# Altium project VENTUNOQ.PrjPcb (part 6 of 18)

## Sheet USB.SchDoc: USB
size A3; Author: Silvio Navaretti; CompanyName: ARDUINO; DrawnBy: Silvio Navaretti; Engineer: Silvio Navaretti; Organization: ARDUINO; SheetNumber: 30; SheetTotal: 51; RevAuthor: Silvio Navaretti
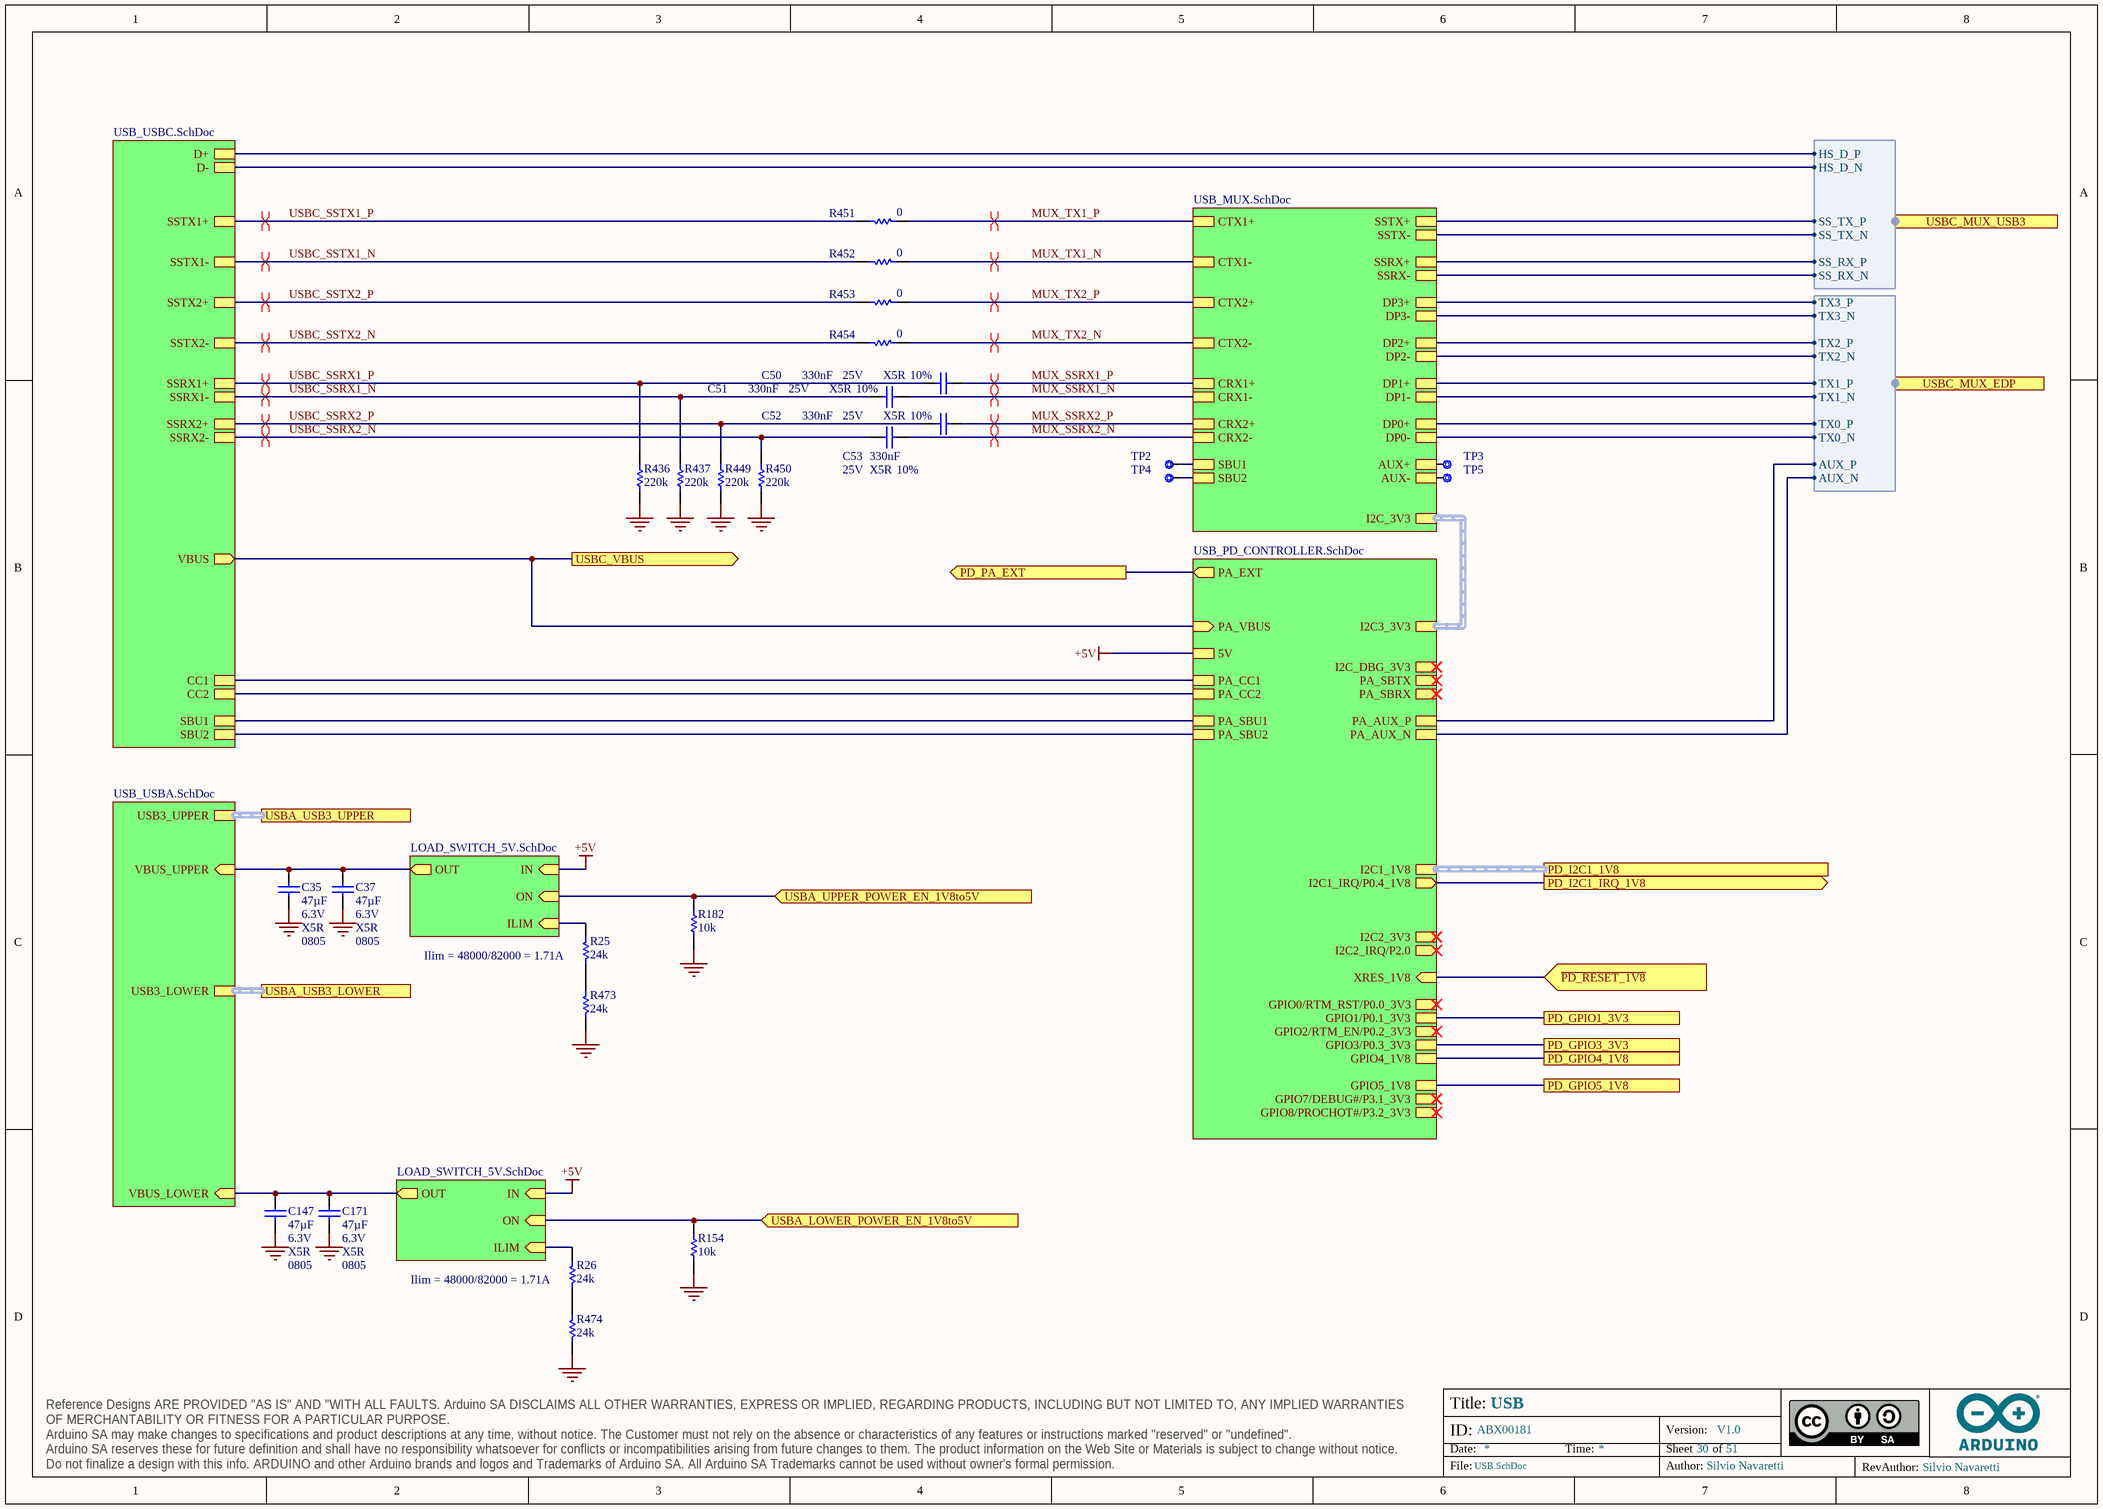
[diagram p11: USB.SchDoc]

### Parts
C35  value 47µF  Voltage: 6.3V  Dielectric: X5R  Case Code (Imperial): 0805  [CAP-0805]  (hidden comment: C0805C476M9PAC7800)
C37  value 47µF  Voltage: 6.3V  Dielectric: X5R  Case Code (Imperial): 0805  [CAP-0805]  (hidden comment: C0805C476M9PAC7800)
C50  value 330nF  Voltage: 25V  Dielectric: X5R  Tolerance: 10%  [CAP-0201]  (hidden comment: CL03A334KA3NRNC)
C51  value 330nF  Voltage: 25V  Dielectric: X5R  Tolerance: 10%  [CAP-0201]  (hidden comment: CL03A334KA3NRNC)
C52  value 330nF  Voltage: 25V  Dielectric: X5R  Tolerance: 10%  [CAP-0201]  (hidden comment: CL03A334KA3NRNC)
C53  value 330nF  Voltage: 25V  Dielectric: X5R  Tolerance: 10%  [CAP-0201]  (hidden comment: CL03A334KA3NRNC)
C147  value 47µF  Voltage: 6.3V  Dielectric: X5R  Case Code (Imperial): 0805  [CAP-0805]  (hidden comment: C0805C476M9PAC7800)
C171  value 47µF  Voltage: 6.3V  Dielectric: X5R  Case Code (Imperial): 0805  [CAP-0805]  (hidden comment: C0805C476M9PAC7800)
R25  value 24k  [RES-0201]  (hidden comment: RC0201FR-0724KL)
R26  value 24k  [RES-0201]  (hidden comment: RC0201FR-0724KL)
R154  value 10k  [RES-0201]  (hidden comment: RC0201FR-0710KL)
R182  value 10k  [RES-0201]  (hidden comment: RC0201FR-0710KL)
R436  value 220k  [RES-0201]  (hidden comment: AC0201FR-07220KL)
R437  value 220k  [RES-0201]  (hidden comment: AC0201FR-07220KL)
R449  value 220k  [RES-0201]  (hidden comment: AC0201FR-07220KL)
R450  value 220k  [RES-0201]  (hidden comment: AC0201FR-07220KL)
R451  value 0  [RES-0201]  (hidden comment: CRCW02010000Z0ED)
R452  value 0  [RES-0201]  (hidden comment: CRCW02010000Z0ED)
R453  value 0  [RES-0201]  (hidden comment: CRCW02010000Z0ED)
R454  value 0  [RES-0201]  (hidden comment: CRCW02010000Z0ED)
R473  value 24k  [RES-0201]  (hidden comment: RC0201FR-0724KL)
R474  value 24k  [RES-0201]  (hidden comment: RC0201FR-0724KL)
TP2  Test point 1.00mm  [TP-1.00MM]  (value not drawn)  (no BOM)
TP3  Test point 1.00mm  [TP-1.00MM]  (value not drawn)  (no BOM)
TP4  Test point 1.00mm  [TP-1.00MM]  (value not drawn)  (no BOM)
TP5  Test point 1.00mm  [TP-1.00MM]  (value not drawn)  (no BOM)

### Sub-sheets
U_LOAD_SWITCH_5V = LOAD_SWITCH_5V.SchDoc: IN (in), OUT (out), ON (in), ILIM (in)
U_LOAD_SWITCH_5V = LOAD_SWITCH_5V.SchDoc: IN (in), OUT (out), ON (in), ILIM (in)
U_USB_MUX = USB_MUX.SchDoc: I2C_3V3 (harness I2C), SSTX-, SSTX+, SBU1, SBU2, SSRX-, SSRX+, DP3+, DP3-, DP2+, DP2-, DP1+, DP1-, DP0+, DP0-, AUX+, AUX-, CTX2+, CTX2-, CRX2+, CRX2-, CRX1+, CRX1-, CTX1+, CTX1-
U_USB_PD_CONTROLLER = USB_PD_CONTROLLER.SchDoc: 5V, PA_VBUS (in), PA_EXT (out), PA_SBU2, PA_SBU1, PA_CC2, PA_CC1, PA_SBTX, PA_SBRX, PA_AUX_P, PA_AUX_N, I2C2_IRQ/P2.0 (out), I2C2_3V3 (harness I2C), I2C3_3V3 (harness I2C), I2C_DBG_3V3 (harness I2C), GPIO0/RTM_RST/P0.0_3V3, GPIO1/P0.1_3V3, GPIO2/RTM_EN/P0.2_3V3, GPIO3/P0.3_3V3, GPIO7/DEBUG#/P3.1_3V3, GPIO8/PROCHOT#/P3.2_3V3, GPIO4_1V8, GPIO5_1V8, I2C1_IRQ/P0.4_1V8 (out), I2C1_1V8 (harness I2C), XRES_1V8 (in)
U_USB_USBA = USB_USBA.SchDoc: VBUS_LOWER (in), USB3_LOWER (harness SOM_MD_USB0), VBUS_UPPER (in), USB3_UPPER (harness SOM_MD_USB0)
U_USB_USBC = USB_USBC.SchDoc: D-, D+, CC1, CC2, SSTX2-, SSTX2+, SSTX1-, SSTX1+, VBUS (out), SBU1, SBU2, SSRX2-, SSRX2+, SSRX1-, SSRX1+

### Ports
PD_GPIO1_3V3, PD_GPIO3_3V3, PD_GPIO4_1V8, PD_GPIO5_1V8, PD_I2C1_1V8 (harness I2C), PD_I2C1_IRQ_1V8 (out), PD_PA_EXT (out), USBA_LOWER_POWER_EN_1V8to5V (in), USBA_UPPER_POWER_EN_1V8to5V (in), USBA_USB3_LOWER (harness SOM_MD_EDP0), USBA_USB3_UPPER (harness SOM_MD_EDP0), USBC_MUX_EDP (harness SOM_MD_EDP0), USBC_MUX_USB3 (harness SOM_MD_USB0), USBC_VBUS (out), ~{PD_RESET_1V8} (in)

### Harnesses
SOM_MD_USB0: SS_TX_N, SS_TX_P, HS_D_P, HS_D_N, SS_RX_P, SS_RX_N
SOM_MD_EDP0: TX0_P, TX1_P, TX2_P, TX3_P, AUX_P, TX0_N, TX1_N, TX2_N, TX3_N, AUX_N

### Nets
+5V: sheet U_USB_PD_CONTROLLER/5V, sheet U_LOAD_SWITCH_5V/IN, sheet U_LOAD_SWITCH_5V/IN
GND: C35.1 C37.1 C147.1 C171.1 R154.1 R182.1 R436.2 R437.2 R449.2 R450.2 R473.1 R474.1
EDP0_AUX_N: sheet U_USB_PD_CONTROLLER/PA_AUX_N, port USBC_MUX_EDP.AUX_N
EDP0_AUX_P: sheet U_USB_PD_CONTROLLER/PA_AUX_P, port USBC_MUX_EDP.AUX_P
EDP0_TX0_N: sheet U_USB_MUX/DP0-, port USBC_MUX_EDP.TX0_N
EDP0_TX0_P: sheet U_USB_MUX/DP0+, port USBC_MUX_EDP.TX0_P
EDP0_TX1_N: sheet U_USB_MUX/DP1-, port USBC_MUX_EDP.TX1_N
EDP0_TX1_P: sheet U_USB_MUX/DP1+, port USBC_MUX_EDP.TX1_P
EDP0_TX2_N: sheet U_USB_MUX/DP2-, port USBC_MUX_EDP.TX2_N
EDP0_TX2_P: sheet U_USB_MUX/DP2+, port USBC_MUX_EDP.TX2_P
EDP0_TX3_N: sheet U_USB_MUX/DP3-, port USBC_MUX_EDP.TX3_N
EDP0_TX3_P: sheet U_USB_MUX/DP3+, port USBC_MUX_EDP.TX3_P
MD_GPIO_3: port PD_I2C1_IRQ_1V8, sheet U_USB_PD_CONTROLLER/I2C1_IRQ/P0.4_1V8
MD_GPIO_48: port PD_GPIO5_1V8, sheet U_USB_PD_CONTROLLER/GPIO5_1V8
MD_GPIO_94: port PD_GPIO4_1V8, sheet U_USB_PD_CONTROLLER/GPIO4_1V8
MD_GPIO_104: port ~{PD_RESET_1V8}, sheet U_USB_PD_CONTROLLER/XRES_1V8
MD_USB0_3.1.HS_D_N: sheet U_USB_USBC/D-, port USBC_MUX_USB3.HS_D_N
MD_USB0_3.1.HS_D_P: sheet U_USB_USBC/D+, port USBC_MUX_USB3.HS_D_P
MD_USB0_3.1.SS_RX_N: sheet U_USB_MUX/SSRX-, port USBC_MUX_USB3.SS_RX_N
MD_USB0_3.1.SS_RX_P: sheet U_USB_MUX/SSRX+, port USBC_MUX_USB3.SS_RX_P
MD_USB0_3.1.SS_TX_N: sheet U_USB_MUX/SSTX-, port USBC_MUX_USB3.SS_TX_N
MD_USB0_3.1.SS_TX_P: sheet U_USB_MUX/SSTX+, port USBC_MUX_USB3.SS_TX_P
MUX_SSRX1_N: C51.1 ; sheet U_USB_MUX/CRX1-
MUX_SSRX1_P: C50.1 ; sheet U_USB_MUX/CRX1+
MUX_SSRX2_N: C53.1 ; sheet U_USB_MUX/CRX2-
MUX_SSRX2_P: C52.1 ; sheet U_USB_MUX/CRX2+
MUX_TX1_N: R452.2 ; sheet U_USB_MUX/CTX1-
MUX_TX1_P: R451.2 ; sheet U_USB_MUX/CTX1+
MUX_TX2_N: R454.2 ; sheet U_USB_MUX/CTX2-
MUX_TX2_P: R453.2 ; sheet U_USB_MUX/CTX2+
PA_VBUS: port USBC_VBUS, sheet U_USB_USBC/VBUS, sheet U_USB_PD_CONTROLLER/PA_VBUS
USBC_CC1: sheet U_USB_USBC/CC1, sheet U_USB_PD_CONTROLLER/PA_CC1
USBC_CC2: sheet U_USB_USBC/CC2, sheet U_USB_PD_CONTROLLER/PA_CC2
USBC_SBU1: sheet U_USB_USBC/SBU1, sheet U_USB_PD_CONTROLLER/PA_SBU1
USBC_SBU2: sheet U_USB_USBC/SBU2, sheet U_USB_PD_CONTROLLER/PA_SBU2
USBC_SSRX1_N: C51.2 R437.1 ; sheet U_USB_USBC/SSRX1-
USBC_SSRX1_P: C50.2 R436.1 ; sheet U_USB_USBC/SSRX1+
USBC_SSRX2_N: C53.2 R450.1 ; sheet U_USB_USBC/SSRX2-
USBC_SSRX2_P: C52.2 R449.1 ; sheet U_USB_USBC/SSRX2+
USBC_SSTX1_N: R452.1 ; sheet U_USB_USBC/SSTX1-
USBC_SSTX1_P: R451.1 ; sheet U_USB_USBC/SSTX1+
USBC_SSTX2_N: R454.1 ; sheet U_USB_USBC/SSTX2-
USBC_SSTX2_P: R453.1 ; sheet U_USB_USBC/SSTX2+
NetC35_2: C35.2 C37.2 ; sheet U_USB_USBA/VBUS_UPPER, sheet U_LOAD_SWITCH_5V/OUT
NetC147_2: C147.2 C171.2 ; sheet U_USB_USBA/VBUS_LOWER, sheet U_LOAD_SWITCH_5V/OUT
NetQ3_2: port PD_GPIO3_3V3, sheet U_USB_PD_CONTROLLER/GPIO3/P0.3_3V3
NetQ3_3: port PD_GPIO1_3V3, sheet U_USB_PD_CONTROLLER/GPIO1/P0.1_3V3
NetR25_1: R25.1 R473.2
NetR25_2: R25.2 ; sheet U_LOAD_SWITCH_5V/ILIM
NetR26_1: R26.1 R474.2
NetR26_2: R26.2 ; sheet U_LOAD_SWITCH_5V/ILIM
NetR154_2: R154.2 ; port USBA_LOWER_POWER_EN_1V8to5V, sheet U_LOAD_SWITCH_5V/ON
NetR182_2: R182.2 ; port USBA_UPPER_POWER_EN_1V8to5V, sheet U_LOAD_SWITCH_5V/ON
NetR215_1: port PD_PA_EXT, sheet U_USB_PD_CONTROLLER/PA_EXT
NetTP2_X: TP2.X ; sheet U_USB_MUX/SBU1
NetTP3_X: TP3.X ; sheet U_USB_MUX/AUX+
NetTP4_X: TP4.X ; sheet U_USB_MUX/SBU2
NetTP5_X: TP5.X ; sheet U_USB_MUX/AUX-

### Buses and harness runs
harness port PD_I2C1_1V8 = sheet U_USB_PD_CONTROLLER/I2C1_1V8
harness port USBA_USB3_LOWER = sheet U_USB_USBA/USB3_LOWER
harness port USBA_USB3_UPPER = sheet U_USB_USBA/USB3_UPPER
harness sheet U_USB_MUX/I2C_3V3 = sheet U_USB_PD_CONTROLLER/I2C3_3V3

### Layout directives
differential pair; differential pair class DIFF_MUX_USBC; net class NET_DIFF_USBC: MUX_SSRX1_N, MUX_SSRX1_P, MUX_SSRX2_N, MUX_SSRX2_P, MUX_TX1_N, MUX_TX1_P, MUX_TX2_N, MUX_TX2_P
differential pair; differential pair class DIFF_MUXCAPS_USBC; net class NET_DIFF_USB: USBC_SSRX1_N, USBC_SSRX1_P, USBC_SSRX2_N, USBC_SSRX2_P, USBC_SSTX1_N, USBC_SSTX1_P, USBC_SSTX2_N, USBC_SSTX2_P

### Notes on the sheet
- (near R25) Ilim = 48000/82000 = 1.71A
- (near R26) Ilim = 48000/82000 = 1.71A
- Title:
- ID:
- Date:
- Time:
- Version:
- Sheet
- of
- RevAuthor:
- Reference Designs ARE PROVIDED "AS IS" AND "WITH ALL FAULTS. Arduino SA DISCLAIMS ALL OTHER WARRANTIES, EXPRESS OR IMPLIED, REGARDING PRODUCTS, INCLUDING BUT NOT LIMITED TO, ANY IMPLIED WARRANTIES OF MERCHANTABILITY OR FITNESS FOR A PARTICULAR PURPOSE.
  Arduino SA may make changes to specifications and product descriptions at any time, without notice. The Customer must not rely on the absence or characteristics of any features or instructions marked "reserved" or "undefined".
  Arduino SA reserves these for future definition and shall have no responsibility whatsoever for conflicts or incompatibilities arising from future changes to them. The product information on the Web Site or Materials is subject to change without notice.
  Do not finalize a design with this info. ARDUINO and other Arduino brands and logos and Trademarks of Arduino SA. All Arduino SA Trademarks cannot be used without owner's formal permission.
- File:
- Author:

### Library data of the parts
C35 C37 C147 C171 = C0199-A.1: CAP CHIP 0805 47uF 20% 6.3V X5R; Manufacturer: KEMET; Code Arduino: C0199; Technology: Ceramic; Tolerance: 20%; Part Number: C0805C476M9PAC7800
C50-C53 = C0201-A.1: CAP CHIP 0201 330nF 10% 25V X5R; Manufacturer: Samsung Electro-Mechanics; Code Arduino: C0201; Part Number: CL03A334KA3NRNC; Case Code (Imperial): 0201; Technology: Ceramic
R25 R26 R473 R474 = R0398-A.1: RES CHIP 0201 24k 1% 1/20W; Manufacturer: YAGEO; Power: 50mW; Code Arduino: R0398; Temperature Coefficient: 200ppm; Technology: Thick film; Tolerance: 1%; Case Code (Imperial): 0201; Part Number: RC0201FR-0724KL
R154 R182 = R0145-A.21: RES CHIP 0201 10k 1% 1/20W; Manufacturer: Yageo; Power: 50mW; Temperature coefficient: 200ppm; Code Arduino: R0145; Manufacturer 2: Samsung Electro-Mechanics; Tolerance: 1%; Case Code (Imperial): 0201; Part Number: RC0201FR-0710KL; Technology: Thick film
R436 R437 R449 R450 = R0199-A.20: RES CHIP 0201 220k 1% 1/20W; Manufacturer: Yageo; Temperature coefficient: 200ppm; Power: 50mW; Code Arduino: R0199; Part Number: AC0201FR-07220KL; Tolerance: 1%; Case Code (Imperial): 0201; Technology: Thick film
R451-R454 = R0140-A.21: RES CHIP 0201 0R; Manufacturer: Vishay; Tolerance: 0%; Code Arduino: R0140; Temperature coefficient: 0ppm; Power: 50mW; Technology: Thick film; Case Code (Imperial): 0201; Part Number: CRCW02010000Z0ED
TP2-TP5 = UT0013-A.6: Part Number: This is not a component; Design Item ID: CMP-018-0005-A.3; Source: ut.SchLib; Manufacturer: This is not a component; Code Arduino: This is not a component; Pin Count: 1

## Sheet USB_USBC.SchDoc: USBC
size A3; Author: Silvio Navaretti; CompanyName: ARDUINO; DrawnBy: Silvio Navaretti; Engineer: Silvio Navaretti; Organization: ARDUINO; SheetNumber: 31; SheetTotal: 51; RevAuthor: Silvio Navaretti
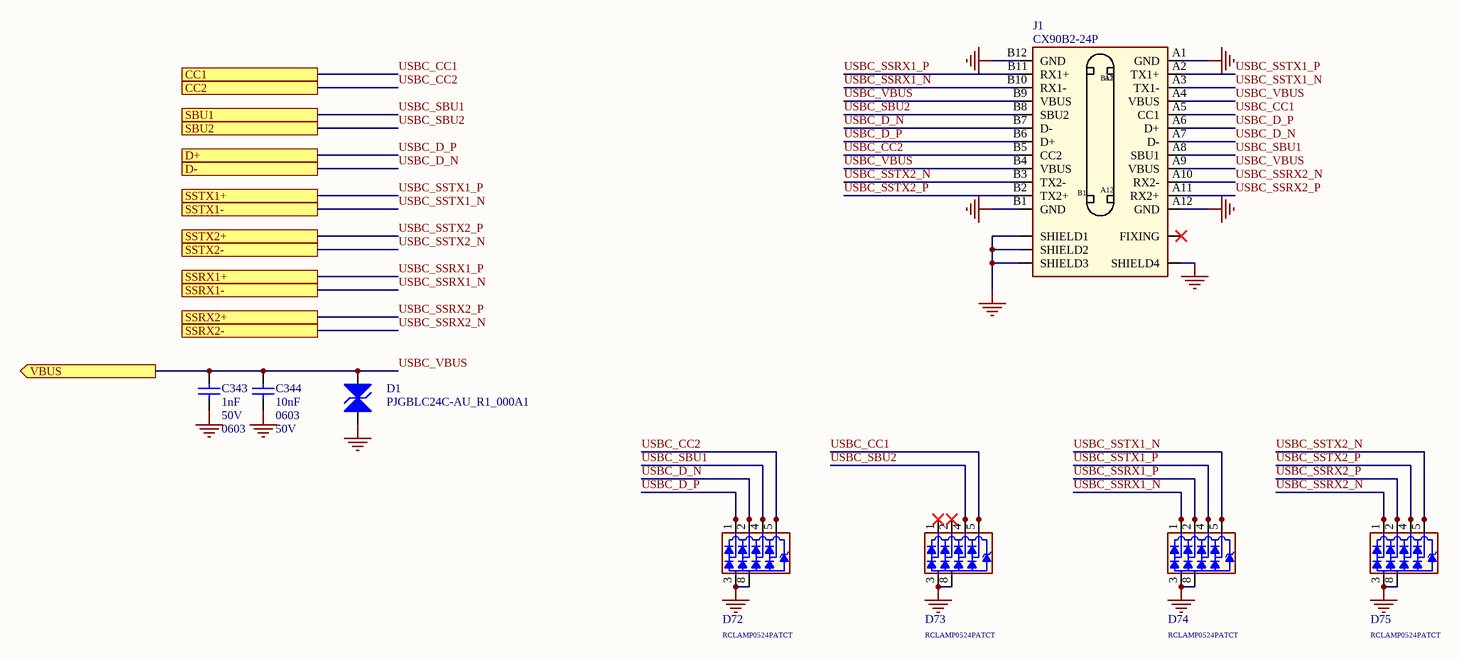
[diagram p12: USB_USBC.SchDoc]

### Parts
C343  value 1nF  Voltage: 50V  Case Code (Imperial): 0603  [CAP-0603]  (hidden comment: CL10B102KB8WPNC)
C344  value 10nF  Case Code (Imperial): 0603  Voltage: 50V  [CAP-0603]  (hidden comment: 0603B103K500CT)
D1  PJGBLC24C-AU_R1_000A1  [SOD323 NO POLARITY]
D72  RCLAMP0524PATCT  [SLP2510P8]
D73  RCLAMP0524PATCT  [SLP2510P8]
D74  RCLAMP0524PATCT  [SLP2510P8]
D75  RCLAMP0524PATCT  [SLP2510P8]
J1  CX90B2-24P  [CX90B2-24P]

### Ports
CC1, CC2, D+, D-, SBU1, SBU2, SSRX1+, SSRX1-, SSRX2+, SSRX2-, SSTX1+, SSTX1-, SSTX2+, SSTX2-, VBUS (out)

### Nets
GND: C343.2 C344.2 D1.1(A1) D72.3 D72.8 D73.3 D73.8 D74.3 D74.8 D75.3 D75.8 J1.A1(GND) J1.A12(GND) J1.B1(GND) J1.B12(GND) J1.SHIELD1 J1.SHIELD2 J1.SHIELD3 J1.SHIELD4
USBC_CC1: D73.5 D73.6 J1.A5(CC1) ; port CC1
USBC_CC2: D72.5 D72.6 J1.B5(CC2) ; port CC2
USBC_D_N: D72.2 D72.9 J1.A7(D-) J1.B7(D-) ; port D-  [project net MD_USB0_3.1.HS_D_N]
USBC_D_P: D72.1 D72.10 J1.A6(D+) J1.B6(D+) ; port D+  [project net MD_USB0_3.1.HS_D_P]
USBC_SBU1: D72.4 D72.7 J1.A8(SBU1) ; port SBU1
USBC_SBU2: D73.4 D73.7 J1.B8(SBU2) ; port SBU2
USBC_SSRX1_N: D74.1 D74.10 J1.B10(RX1-) ; port SSRX1-
USBC_SSRX1_P: D74.2 D74.9 J1.B11(RX1+) ; port SSRX1+
USBC_SSRX2_N: D75.1 D75.10 J1.A10(RX2-) ; port SSRX2-
USBC_SSRX2_P: D75.2 D75.9 J1.A11(RX2+) ; port SSRX2+
USBC_SSTX1_N: D74.5 D74.6 J1.A3(TX1-) ; port SSTX1-
USBC_SSTX1_P: D74.4 D74.7 J1.A2(TX1+) ; port SSTX1+
USBC_SSTX2_N: D75.5 D75.6 J1.B3(TX2-) ; port SSTX2-
USBC_SSTX2_P: D75.4 D75.7 J1.B2(TX2+) ; port SSTX2+
USBC_VBUS: C343.1 C344.1 D1.2(A2) J1.A4(VBUS) J1.A9(VBUS) J1.B4(VBUS) J1.B9(VBUS) ; port VBUS  [project net PA_VBUS]
NetD73_1: D73.1 D73.10
NetD73_2: D73.2 D73.9

Not connected (* = marked no-connect by the designer): J1 FIXING*

### Notes on the sheet
- Title:
- ID:
- Date:
- Time:
- Version:
- Sheet
- of
- RevAuthor:
- Reference Designs ARE PROVIDED "AS IS" AND "WITH ALL FAULTS. Arduino SA DISCLAIMS ALL OTHER WARRANTIES, EXPRESS OR IMPLIED, REGARDING PRODUCTS, INCLUDING BUT NOT LIMITED TO, ANY IMPLIED WARRANTIES OF MERCHANTABILITY OR FITNESS FOR A PARTICULAR PURPOSE.
  Arduino SA may make changes to specifications and product descriptions at any time, without notice. The Customer must not rely on the absence or characteristics of any features or instructions marked "reserved" or "undefined".
  Arduino SA reserves these for future definition and shall have no responsibility whatsoever for conflicts or incompatibilities arising from future changes to them. The product information on the Web Site or Materials is subject to change without notice.
  Do not finalize a design with this info. ARDUINO and other Arduino brands and logos and Trademarks of Arduino SA. All Arduino SA Trademarks cannot be used without owner's formal permission.
- File:
- Author:

### Library data of the parts
C343 = C0063-A.3: CAP CHIP 0603 1nF 10% 50V X7R; Manufacturer: Samsung Electro-Mechanics; Code Arduino: C0063; Tolerance: 10%; Part Number: CL10B102KB8WPNC; Dielectric: X7R
C344 = C0040-A.14: CAP CHIP 0603 10nF 10% 50V X7R; Manufacturer: Walsin; Code Arduino: 0142; Technology: Ceramic; Part number 3: CL10B103KC8NNNC; Part Number: 0603B103K500CT; Dielectric: X7R; Manufacturer 2: Hottech; Part number 2: C1608B103K500NT; Tolerance: 10%
D1 = D0098-A.2: TVS BIDIRECTIONAL SMD Vr 24V, Vbr min 27.27V, 350W, SOD-323; V(BR) Typ (V): 26.7; Code Arduino: D0098; Part Number: PJGBLC24C-AU_R1_000A1
D72-D75 = D0097-A.6: TVS UNIDIRECTIONAL 4CH 0.8pF 5V SLP2510P8 10-pin 2.5x1.0x0.58mm; Manufacturer: SEMTECH; Code Arduino: D0097; Device Type: ESD protection; Part Number: RCLAMP0524PATCT
J1 = J0010-A.12: CONN RCPT USB3.1 TYPEC 24POS SMD; Manufacturer: Hirose; Code Arduino: A5518; Gender: Receptacle; Connector Type: USB; Part Number: CX90B2-24P

## Sheet USB_MUX.SchDoc: USB MUX
size A3; Author: Silvio Navaretti; CompanyName: ARDUINO; DrawnBy: Silvio Navaretti; Engineer: Silvio Navaretti; Organization: ARDUINO; SheetNumber: 32; SheetTotal: 51; RevAuthor: Silvio Navaretti
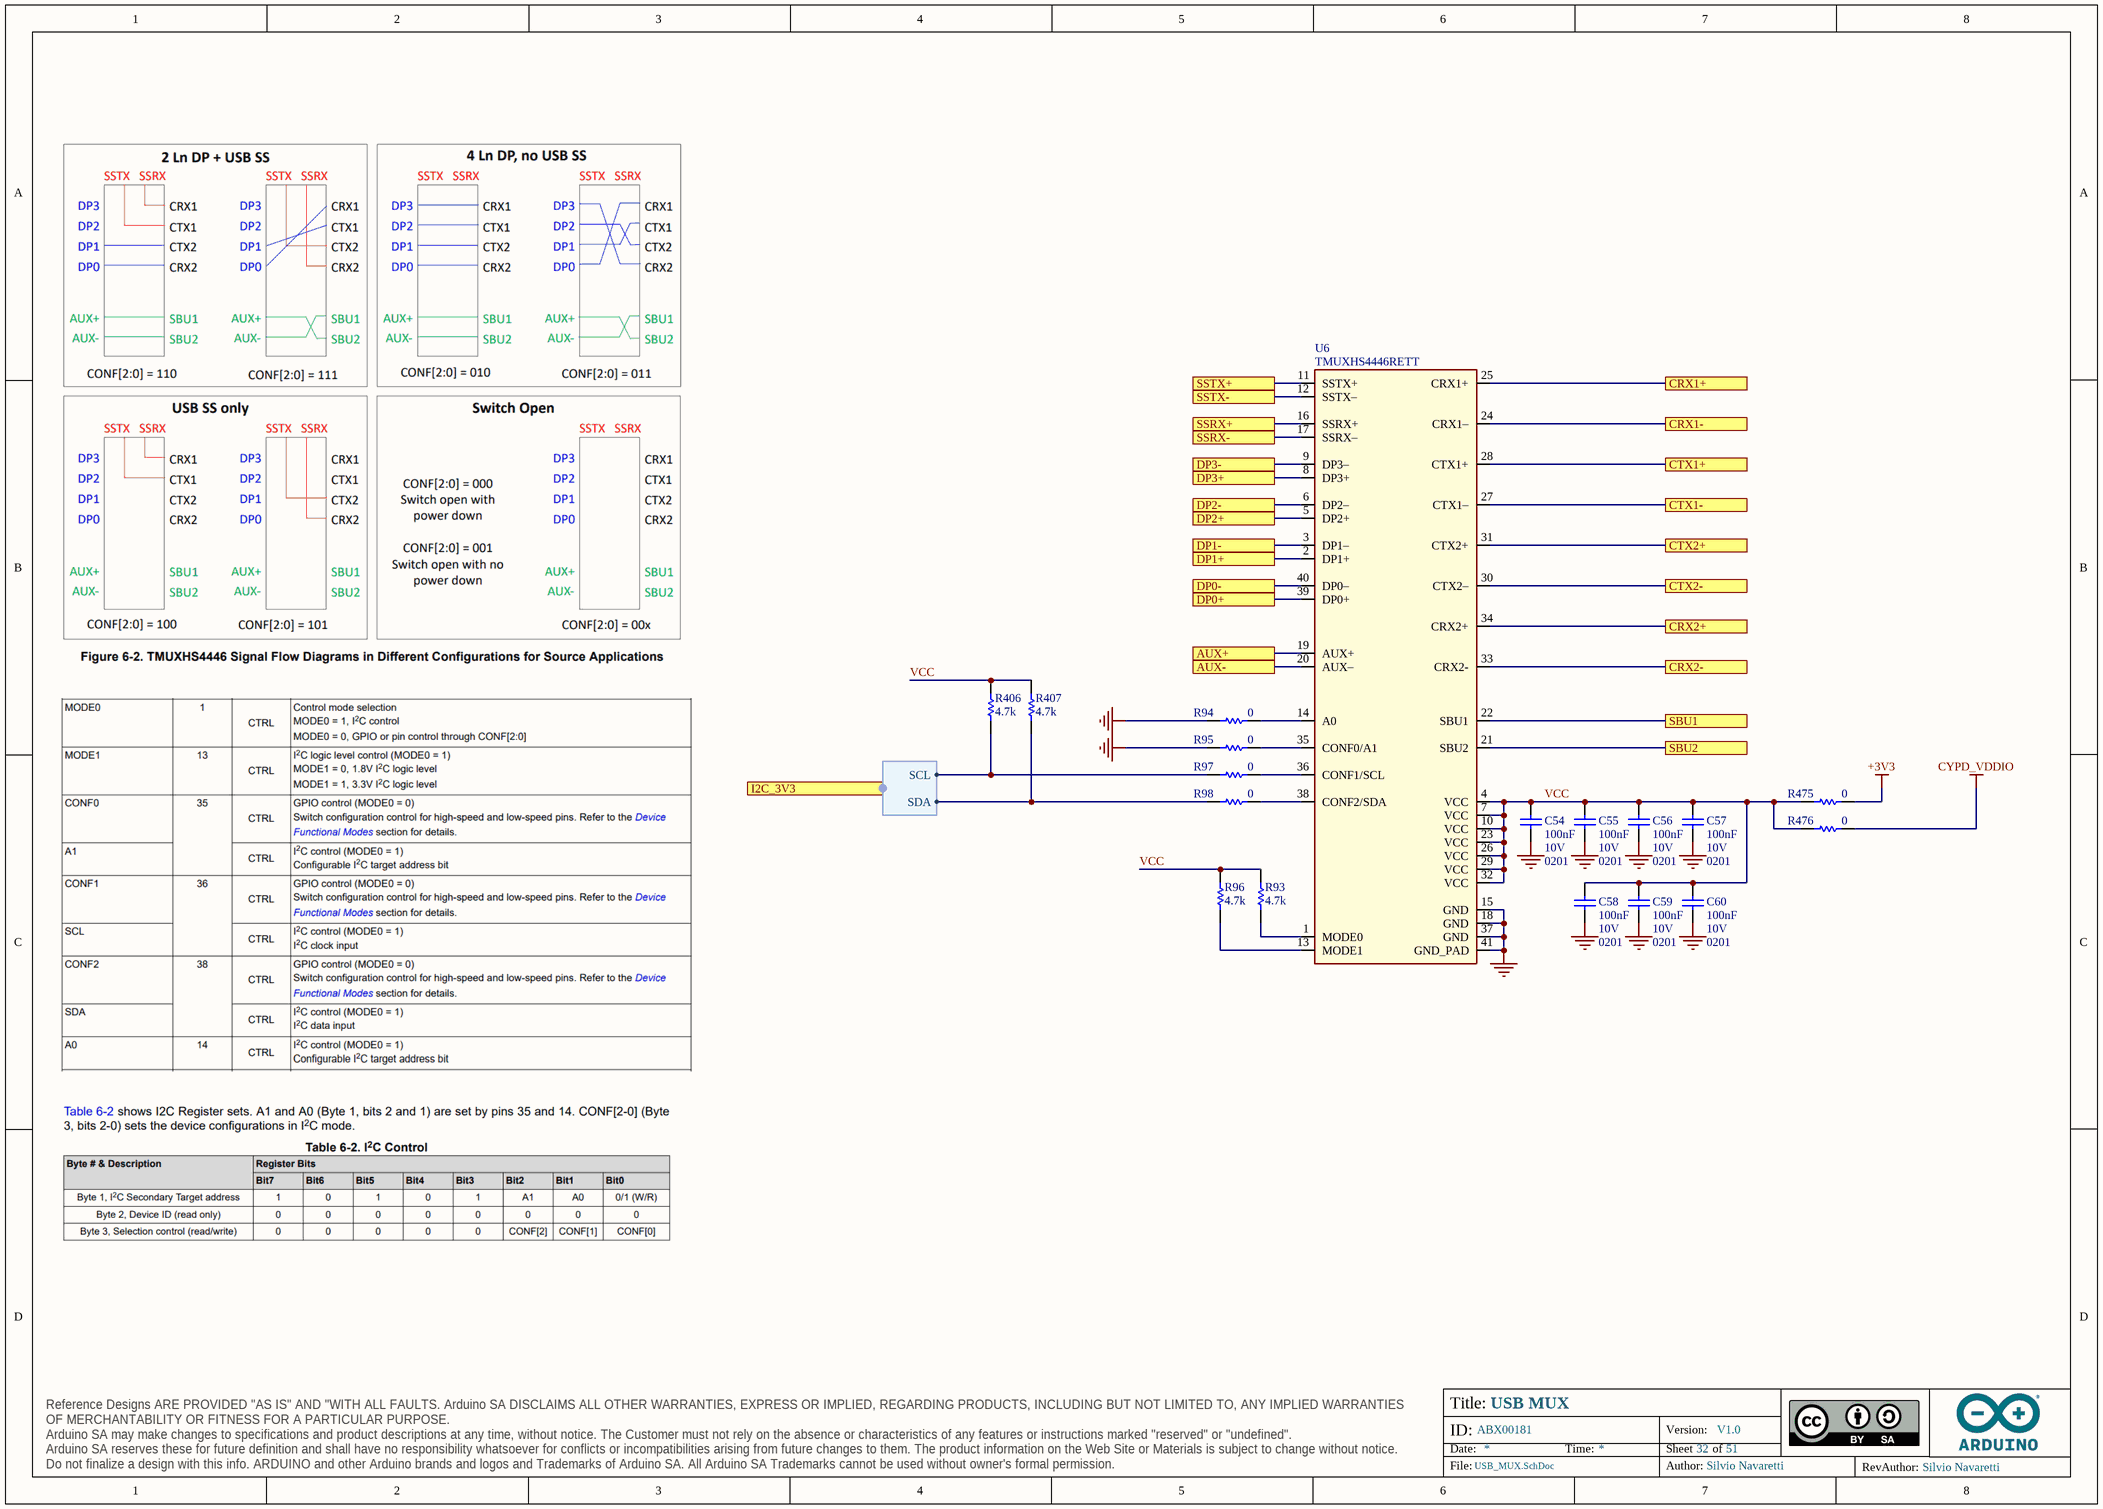
[diagram p13: USB_MUX.SchDoc]

### Parts
C54  value 100nF  Voltage: 10V  Case Code (Imperial): 0201  [CAP-0201]  (hidden comment: CL03A104KP3NNNC)
C55  value 100nF  Voltage: 10V  Case Code (Imperial): 0201  [CAP-0201]  (hidden comment: CL03A104KP3NNNC)
C56  value 100nF  Voltage: 10V  Case Code (Imperial): 0201  [CAP-0201]  (hidden comment: CL03A104KP3NNNC)
C57  value 100nF  Voltage: 10V  Case Code (Imperial): 0201  [CAP-0201]  (hidden comment: CL03A104KP3NNNC)
C58  value 100nF  Voltage: 10V  Case Code (Imperial): 0201  [CAP-0201]  (hidden comment: CL03A104KP3NNNC)
C59  value 100nF  Voltage: 10V  Case Code (Imperial): 0201  [CAP-0201]  (hidden comment: CL03A104KP3NNNC)
C60  value 100nF  Voltage: 10V  Case Code (Imperial): 0201  [CAP-0201]  (hidden comment: CL03A104KP3NNNC)
R93  value 4.7k  [RES-0201]  (hidden comment: RC0201FR-074K7L)
R94  value 0  [RES-0201]  (hidden comment: CRCW02010000Z0ED)
R95  value 0  [RES-0201]  (hidden comment: CRCW02010000Z0ED)
R96  value 4.7k  [RES-0201]  (hidden comment: RC0201FR-074K7L)
R97  value 0  [RES-0201]  (hidden comment: CRCW02010000Z0ED)
R98  value 0  [RES-0201]  (hidden comment: CRCW02010000Z0ED)
R406  value 4.7k  [RES-0201]  (hidden comment: RC0201FR-074K7L)
R407  value 4.7k  [RES-0201]  (hidden comment: RC0201FR-074K7L)
R475  value 0  [RES-0201]  (hidden comment: CRCW02010000Z0ED)
R476  value 0  [RES-0201]  (hidden comment: CRCW02010000Z0ED)
U6  TMUXHS4446RETT  [TI QWFN40 RET0040A Pitch 0.4mm 3x6mm]

### Ports
AUX+, AUX-, CRX1+, CRX1-, CRX2+, CRX2-, CTX1+, CTX1-, CTX2+, CTX2-, DP0+, DP0-, DP1+, DP1-, DP2+, DP2-, DP3+, DP3-, I2C_3V3 (harness I2C), SBU1, SBU2, SSRX+, SSRX-, SSTX+, SSTX-

### Harnesses
I2C: SDA, SCL

### Nets
+3V3: R475.2
CYPD_VDDIO: R476.2
GND: C54.1 C55.1 C56.1 C57.1 C58.1 C59.1 C60.1 R94.1 R95.1 U6.15(GND) U6.18(GND) U6.37(GND) U6.41(GND_PAD)
EDP0_TX0_N: U6.40(DP0–) ; port DP0-
EDP0_TX0_P: U6.39(DP0+) ; port DP0+
EDP0_TX1_N: U6.3(DP1–) ; port DP1-
EDP0_TX1_P: U6.2(DP1+) ; port DP1+
EDP0_TX2_N: U6.6(DP2–) ; port DP2-
EDP0_TX2_P: U6.5(DP2+) ; port DP2+
EDP0_TX3_N: U6.9(DP3–) ; port DP3-
EDP0_TX3_P: U6.8(DP3+) ; port DP3+
MD_USB0_3.1.SS_RX_N: U6.17(SSRX–) ; port SSRX-
MD_USB0_3.1.SS_RX_P: U6.16(SSRX+) ; port SSRX+
MD_USB0_3.1.SS_TX_N: U6.12(SSTX–) ; port SSTX-
MD_USB0_3.1.SS_TX_P: U6.11(SSTX+) ; port SSTX+
MUX_SSRX1_N: U6.24(CRX1–) ; port CRX1-
MUX_SSRX1_P: U6.25(CRX1+) ; port CRX1+
MUX_SSRX2_N: U6.33(CRX2-) ; port CRX2-
MUX_SSRX2_P: U6.34(CRX2+) ; port CRX2+
MUX_TX1_N: U6.27(CTX1–) ; port CTX1-
MUX_TX1_P: U6.28(CTX1+) ; port CTX1+
MUX_TX2_N: U6.30(CTX2–) ; port CTX2-
MUX_TX2_P: U6.31(CTX2+) ; port CTX2+
VCC: C54.2 C55.2 C56.2 C57.2 C58.2 C59.2 C60.2 R93.1 R96.1 R406.1 R407.1 R475.1 R476.1 U6.4(VCC) U6.7(VCC) U6.10(VCC) U6.23(VCC) U6.26(VCC) U6.29(VCC) U6.32(VCC)  [project net VCC_32]
NetR93_2: R93.2 U6.1(MODE0)
NetR94_2: R94.2 U6.14(A0)
NetR95_2: R95.2 U6.35(CONF0/A1)
NetR96_2: R96.2 U6.13(MODE1)
NetR97_1: R97.1 R406.2 ; port I2C_3V3.SCL
NetR97_2: R97.2 U6.36(CONF1/SCL)
NetR98_1: R98.1 R407.2 ; port I2C_3V3.SDA
NetR98_2: R98.2 U6.38(CONF2/SDA)
NetTP2_X: U6.22(SBU1) ; port SBU1
NetTP3_X: U6.19(AUX+) ; port AUX+
NetTP4_X: U6.21(SBU2) ; port SBU2
NetTP5_X: U6.20(AUX–) ; port AUX-

### Notes on the sheet
- Title:
- ID:
- Date:
- Time:
- Version:
- Sheet
- of
- RevAuthor:
- Reference Designs ARE PROVIDED "AS IS" AND "WITH ALL FAULTS. Arduino SA DISCLAIMS ALL OTHER WARRANTIES, EXPRESS OR IMPLIED, REGARDING PRODUCTS, INCLUDING BUT NOT LIMITED TO, ANY IMPLIED WARRANTIES OF MERCHANTABILITY OR FITNESS FOR A PARTICULAR PURPOSE.
  Arduino SA may make changes to specifications and product descriptions at any time, without notice. The Customer must not rely on the absence or characteristics of any features or instructions marked "reserved" or "undefined".
  Arduino SA reserves these for future definition and shall have no responsibility whatsoever for conflicts or incompatibilities arising from future changes to them. The product information on the Web Site or Materials is subject to change without notice.
  Do not finalize a design with this info. ARDUINO and other Arduino brands and logos and Trademarks of Arduino SA. All Arduino SA Trademarks cannot be used without owner's formal permission.
- File:
- Author:

### Library data of the parts
C54-C60 = C0113-A.6: CAP CHIP 0201 100nF 10% 10V X5R; Manufacturer: Samsung Electro-Mechanics; Code Arduino: C0113; Technology: Ceramic; Part Number: CL03A104KP3NNNC; Dielectric: X5R; Tolerance: 10%
R93 R96 R406 R407 = R0151-A.21: RES CHIP 0201 4k7 1% 1/20W; Manufacturer: Yageo; Temperature coefficient: 200ppm; Power: 50mW; Code Arduino: A5521; Technology: Thick film; Case Code (Imperial): 0201; Part Number: RC0201FR-074K7L; Tolerance: 1%
R94 R95 R97 R98 R475 R476 = R0140-A.21: RES CHIP 0201 0R; Manufacturer: Vishay; Temperature coefficient: 0ppm; Code Arduino: R0140; Power: 50mW; Tolerance: 0%; Technology: Thick film; Case Code (Imperial): 0201; Part Number: CRCW02010000Z0ED
U6 = U0499-A.3: IC MUX Alt Mode Crossbar USB-C 10Gbps, QFN40 3x6mm; Manufacturer: Texas Instruments; Code Arduino: U0499; Part Number: TMUXHS4446RETT

## Sheet USB_PD_CONTROLLER.SchDoc: USB PD CONTROLLER
size A3; Author: Silvio Navaretti; CompanyName: ARDUINO; DrawnBy: Silvio Navaretti; Engineer: Silvio Navaretti; Organization: ARDUINO; SheetNumber: 33; SheetTotal: 51; RevAuthor: Silvio Navaretti
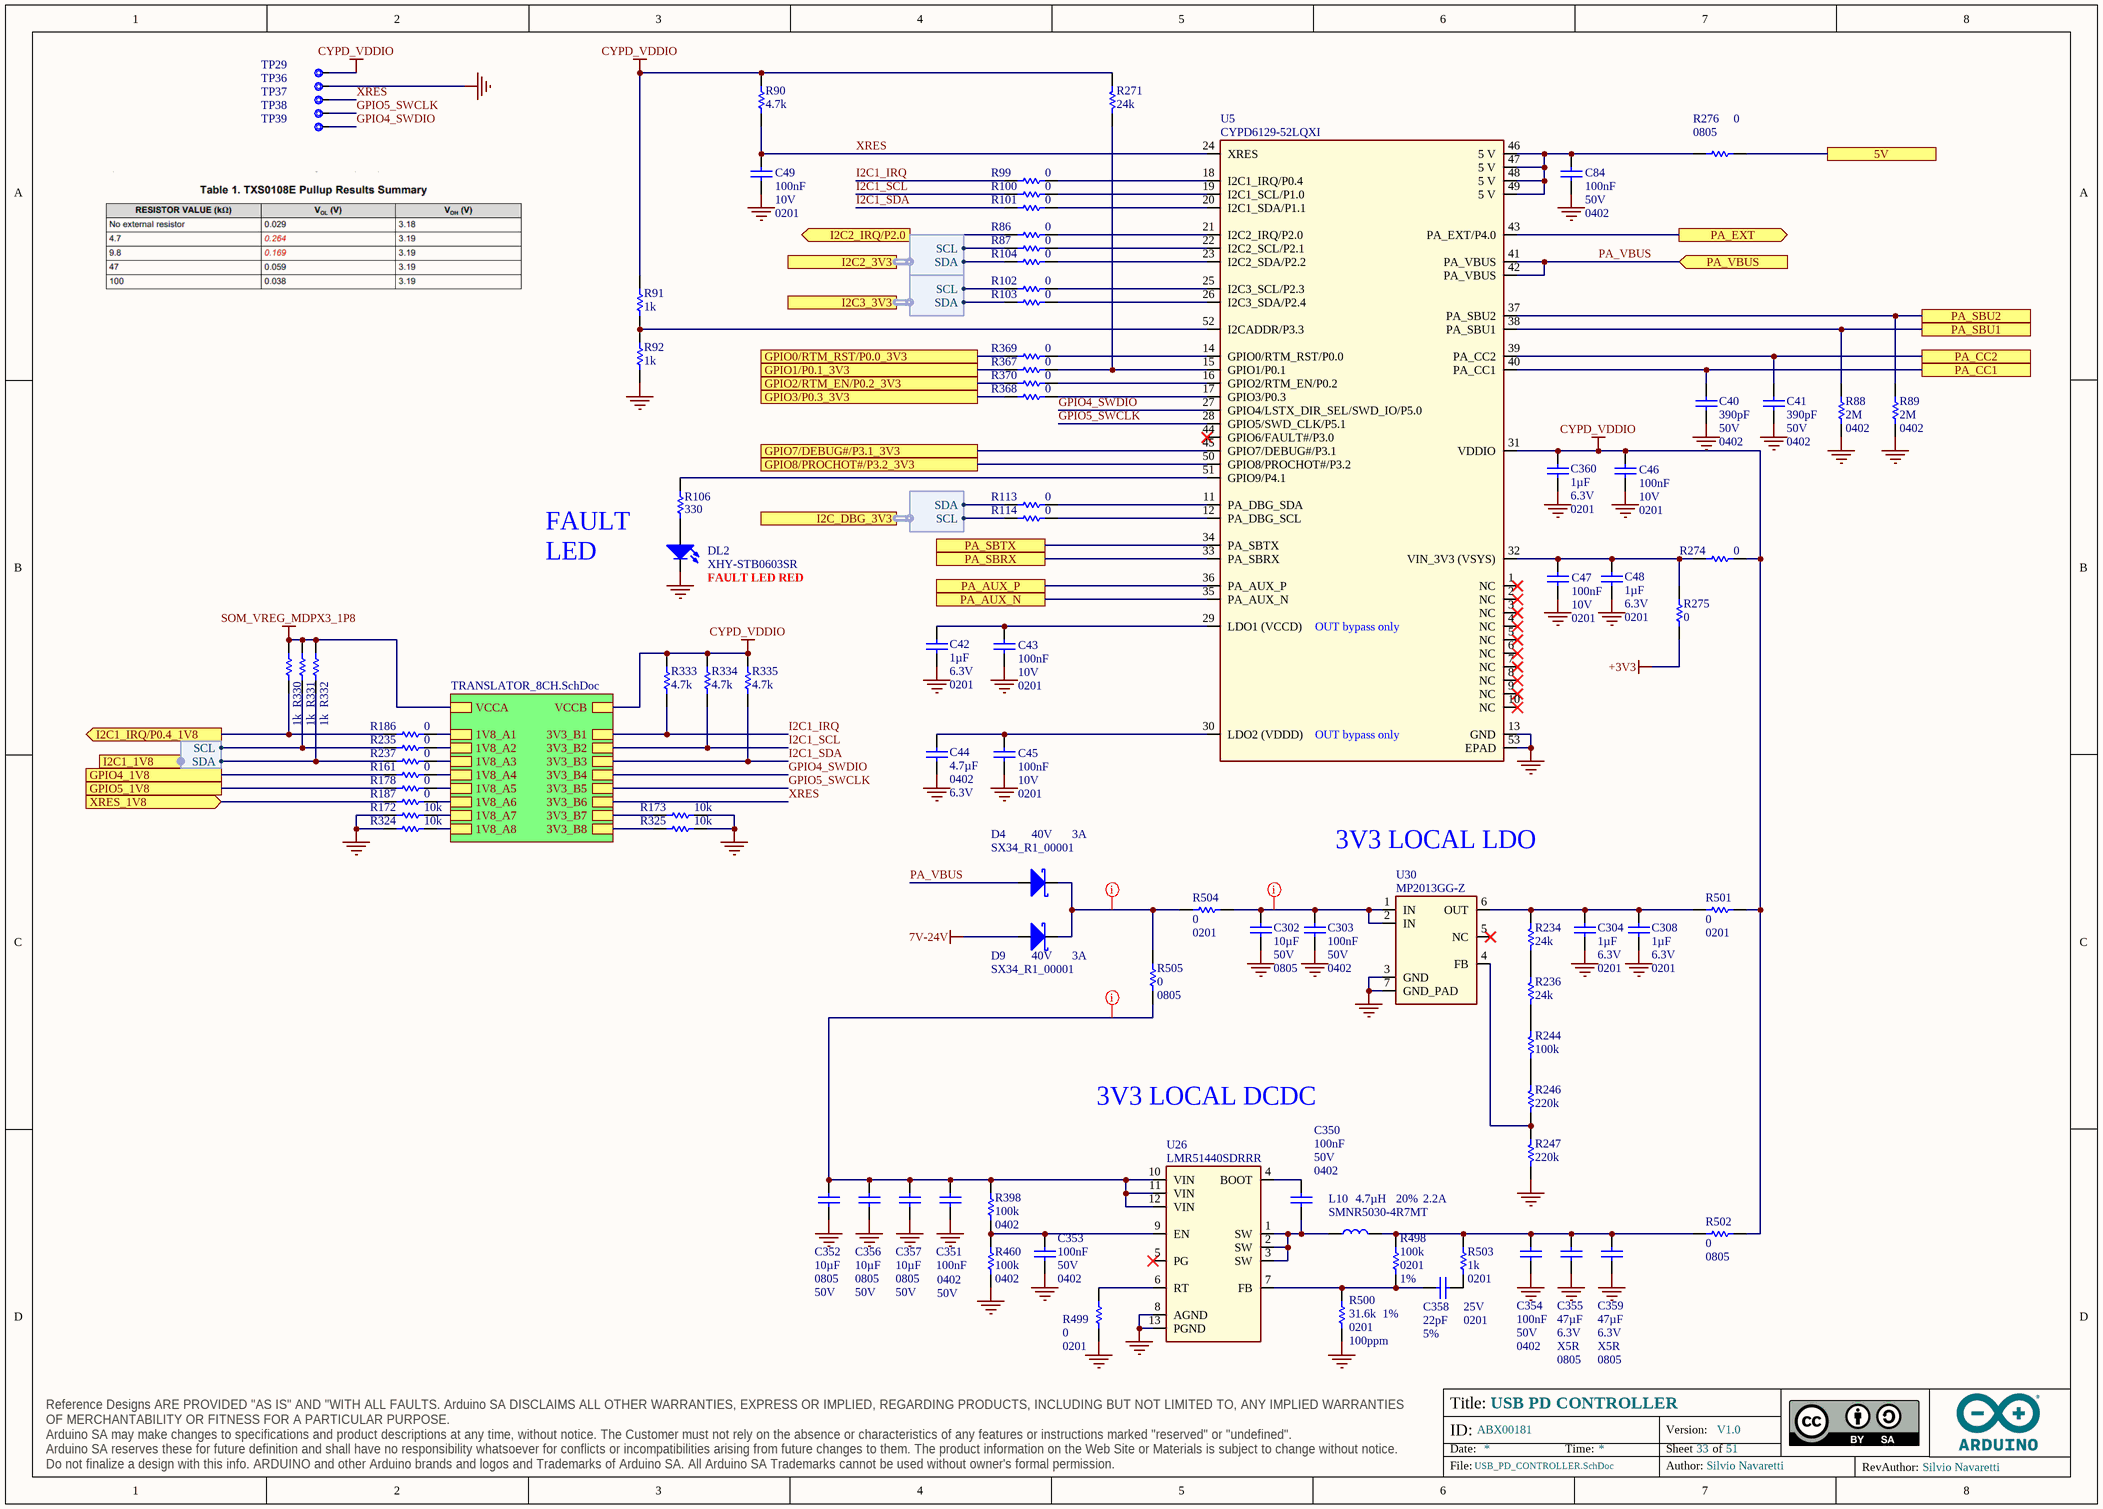
[diagram p14: USB_PD_CONTROLLER.SchDoc]

### Parts
C40  value 390pF  Voltage: 50V  Case Code (Imperial): 0402  [CAP-0402]  (hidden comment: CL05B391KB5NNNC)
C41  value 390pF  Voltage: 50V  Case Code (Imperial): 0402  [CAP-0402]  (hidden comment: CL05B391KB5NNNC)
C42  value 1µF  Voltage: 6.3V  Case Code (Imperial): 0201  [CAP-0201]  (hidden comment: GRM033R60J105MEA2D)
C43  value 100nF  Voltage: 10V  Case Code (Imperial): 0201  [CAP-0201]  (hidden comment: CL03A104KP3NNNC)
C44  value 4.7µF  Case Code (Imperial): 0402  Voltage: 6.3V  [CAP-0402]  (hidden comment: C1005A475M6R3NT)
C45  value 100nF  Voltage: 10V  Case Code (Imperial): 0201  [CAP-0201]  (hidden comment: CL03A104KP3NNNC)
C46  value 100nF  Voltage: 10V  Case Code (Imperial): 0201  [CAP-0201]  (hidden comment: CL03A104KP3NNNC)
C47  value 100nF  Voltage: 10V  Case Code (Imperial): 0201  [CAP-0201]  (hidden comment: CL03A104KP3NNNC)
C48  value 1µF  Voltage: 6.3V  Case Code (Imperial): 0201  [CAP-0201]  (hidden comment: GRM033R60J105MEA2D)
C49  value 100nF  Voltage: 10V  Case Code (Imperial): 0201  [CAP-0201]  (hidden comment: CL03A104KP3NNNC)
C84  value 100nF  Voltage: 50V  Case Code (Imperial): 0402  [CAP-0402]  (hidden comment: GRM155R61H104KE19D)
C302  value 10µF  Voltage: 50V  Case Code (Imperial): 0805  [CAP-0805]  (hidden comment: GRM21BR61H106ME43L)
C303  value 100nF  Voltage: 50V  Case Code (Imperial): 0402  [CAP-0402]  (hidden comment: GRM155R61H104KE19D)
C304  value 1µF  Voltage: 6.3V  Case Code (Imperial): 0201  [CAP-0201]  (hidden comment: GRM033R60J105MEA2D)
C308  value 1µF  Voltage: 6.3V  Case Code (Imperial): 0201  [CAP-0201]  (hidden comment: GRM033R60J105MEA2D)
C350  value 100nF  Voltage: 50V  Case Code (Imperial): 0402  [CAP-0402]  (hidden comment: GRM155R61H104KE19D)
C351  value 100nF  Voltage: 50V  Case Code (Imperial): 0402  [CAP-0402]  (hidden comment: GRM155R61H104KE19D)
C352  value 10µF  Case Code (Imperial): 0805  Voltage: 50V  [CAP-0805]  (hidden comment: GRM21BR61H106ME43L)
C353  value 100nF  Voltage: 50V  Case Code (Imperial): 0402  [CAP-0402]  (hidden comment: GRM155R61H104KE19D)
C354  value 100nF  Voltage: 50V  Case Code (Imperial): 0402  [CAP-0402]  (hidden comment: GRM155R61H104KE19D)
C355  value 47µF  Voltage: 6.3V  Dielectric: X5R  Case Code (Imperial): 0805  [CAP-0805]  (hidden comment: C0805C476M9PAC7800)
C356  value 10µF  Case Code (Imperial): 0805  Voltage: 50V  [CAP-0805]  (hidden comment: GRM21BR61H106ME43L)
C357  value 10µF  Case Code (Imperial): 0805  Voltage: 50V  [CAP-0805]  (hidden comment: GRM21BR61H106ME43L)
C358  value 22pF  Tolerance: 5%  Case Code (Imperial): 0201  Voltage: 25V  [CAP-0201]  (hidden comment: CC0201JPNPO8BN220)
C359  value 47µF  Voltage: 6.3V  Dielectric: X5R  Case Code (Imperial): 0805  [CAP-0805]  (hidden comment: C0805C476M9PAC7800)
C360  value 1µF  Voltage: 6.3V  Case Code (Imperial): 0201  [CAP-0201]  (hidden comment: GRM033R60J105MEA2D)
D4  SX34_R1_00001  Max Reverse Voltage (DC): 40V  Forward Current: 3A  [SMA DO214AC]
D9  SX34_R1_00001  Max Reverse Voltage (DC): 40V  Forward Current: 3A  [SMA DO214AC]
DL2  XHY-STB0603SR  [LEDC1608X80N-AK]
L10  SMNR5030-4R7MT  Tolerance: 20%  IRMS: 2.2A  Inductance: 4.7µH  [Inductor 5030]
R86  value 0  [RES-0201]  (hidden comment: CRCW02010000Z0ED)
R87  value 0  [RES-0201]  (hidden comment: CRCW02010000Z0ED)
R88  value 2M  Case Code (Imperial): 0402  [RES-0402]  (hidden comment: RC0402FR-072ML)
R89  value 2M  Case Code (Imperial): 0402  [RES-0402]  (hidden comment: RC0402FR-072ML)
R90  value 4.7k  [RES-0201]  (hidden comment: RC0201FR-074K7L)
R91  value 1k  [RES-0201]  (hidden comment: RC0201FR-071KL)
R92  value 1k  [RES-0201]  (hidden comment: RC0201FR-071KL)
R99  value 0  [RES-0201]  (hidden comment: CRCW02010000Z0ED)
R100  value 0  [RES-0201]  (hidden comment: CRCW02010000Z0ED)
R101  value 0  [RES-0201]  (hidden comment: CRCW02010000Z0ED)
R102  value 0  [RES-0201]  (hidden comment: CRCW02010000Z0ED)
R103  value 0  [RES-0201]  (hidden comment: CRCW02010000Z0ED)
R104  value 0  [RES-0201]  (hidden comment: CRCW02010000Z0ED)
R106  value 330  [RES-0201]  (hidden comment: AC0201FR-07330RL)
R113  value 0  [RES-0201]  (hidden comment: CRCW02010000Z0ED)
R114  value 0  [RES-0201]  (hidden comment: CRCW02010000Z0ED)
R161  value 0  [RES-0201]  (hidden comment: CRCW02010000Z0ED)
R172  value 10k  [RES-0201]  (hidden comment: RC0201FR-0710KL)
R173  value 10k  [RES-0201]  (hidden comment: RC0201FR-0710KL)
R178  value 0  [RES-0201]  (hidden comment: CRCW02010000Z0ED)
R186  value 0  [RES-0201]  (hidden comment: CRCW02010000Z0ED)
R187  value 0  [RES-0201]  (hidden comment: CRCW02010000Z0ED)
R234  value 24k  [RES-0201]  (hidden comment: RC0201FR-0724KL)
R235  value 0  [RES-0201]  (hidden comment: CRCW02010000Z0ED)
R236  value 24k  [RES-0201]  (hidden comment: RC0201FR-0724KL)
R237  value 0  [RES-0201]  (hidden comment: CRCW02010000Z0ED)
R244  value 100k  [RES-0201]  (hidden comment: RC0201FR-07100KL)
R246  value 220k  [RES-0201]  (hidden comment: AC0201FR-07220KL)
R247  value 220k  [RES-0201]  (hidden comment: AC0201FR-07220KL)
R271  value 24k  [RES-0201]  (hidden comment: RC0201FR-0724KL)
R274  value 0  [RES-0201]  (hidden comment: CRCW02010000Z0ED)
R275  value 0  [RES-0201]  (hidden comment: CRCW02010000Z0ED)
R276  value 0  Case Code (Imperial): 0805  [RES-0805]  (hidden comment: CRCW08050000Z0EB)
R324  value 10k  [RES-0201]  (hidden comment: RC0201FR-0710KL)
R325  value 10k  [RES-0201]  (hidden comment: RC0201FR-0710KL)
R330  value 1k  [RES-0201]  (hidden comment: RC0201FR-071KL)
R331  value 1k  [RES-0201]  (hidden comment: RC0201FR-071KL)
R332  value 1k  [RES-0201]  (hidden comment: RC0201FR-071KL)
R333  value 4.7k  [RES-0201]  (hidden comment: RC0201FR-074K7L)
R334  value 4.7k  [RES-0201]  (hidden comment: RC0201FR-074K7L)
R335  value 4.7k  [RES-0201]  (hidden comment: RC0201FR-074K7L)
R367  value 0  [RES-0201]  (hidden comment: CRCW02010000Z0ED)
R368  value 0  [RES-0201]  (hidden comment: CRCW02010000Z0ED)
R369  value 0  [RES-0201]  (hidden comment: CRCW02010000Z0ED)
R370  value 0  [RES-0201]  (hidden comment: CRCW02010000Z0ED)
R398  value 100k  Case Code (Imperial): 0402  [RES-0402]  (hidden comment: CRCW0402100KFKEDC)
R460  value 100k  Case Code (Imperial): 0402  [RES-0402]  (hidden comment: CRCW0402100KFKEDC)
R498  value 100k  Tolerance: 1%  Case Code (Imperial): 0201  [RES-0201]  (hidden comment: RC0201FR-07100KL)
R499  value 0  Case Code (Imperial): 0201  [RES-0201]  (hidden comment: CRCW02010000Z0ED)
R500  value 31.6k  Case Code (Imperial): 0201  Tolerance: 1%  Temperature Coefficient: 100ppm  [RES-0201]  (hidden comment: CRCW020131K6FKED)
R501  value 0  Case Code (Imperial): 0201  [RES-0201]  (hidden comment: CRCW02010000Z0ED)
R502  value 0  Case Code (Imperial): 0805  [RES-0805]  (hidden comment: CRCW08050000Z0EB)
R503  value 1k  Case Code (Imperial): 0201  [RES-0201]  (hidden comment: RC0201FR-071KL)
R504  value 0  Case Code (Imperial): 0201  [RES-0201]  (hidden comment: CRCW02010000Z0ED)
R505  value 0  Case Code (Imperial): 0805  [RES-0805]  (hidden comment: CRCW08050000Z0EB)
TP29  Test point 1.00mm  [TP-1.00MM]  (value not drawn)  (no BOM)
TP36  Test point 1.00mm  [TP-1.00MM]  (value not drawn)  (no BOM)
TP37  Test point 1.00mm  [TP-1.00MM]  (value not drawn)  (no BOM)
TP38  Test point 1.00mm  [TP-1.00MM]  (value not drawn)  (no BOM)
TP39  Test point 1.00mm  [TP-1.00MM]  (value not drawn)  (no BOM)
U5  CYPD6129-52LQXI  [QFN52 pitch 0.4mm, 5x8mm]
U26  LMR51440SDRRR  [WSON8 TI DDR 3x3mm 12 pins pitch 0.5mm]
U30  MP2013GG-Z  [MPS QNF6 2x2mm 6pin pitch 0.65mm thermal pad]

### Sub-sheets
T8CH_ = TRANSLATOR_8CH.SchDoc: 1V8_A1, 1V8_A2, 1V8_A3, 1V8_A4, 1V8_A5, 1V8_A6, 1V8_A7, 1V8_A8, 3V3_B1, 3V3_B2, 3V3_B3, 3V3_B4, 3V3_B5, 3V3_B6, 3V3_B7, 3V3_B8, VCCA, VCCB

### Ports
5V, GPIO0/RTM_RST/P0.0_3V3, GPIO1/P0.1_3V3, GPIO2/RTM_EN/P0.2_3V3, GPIO3/P0.3_3V3, GPIO4_1V8, GPIO5_1V8, GPIO7/DEBUG#/P3.1_3V3, GPIO8/PROCHOT#/P3.2_3V3, I2C1_1V8 (harness I2C), I2C1_IRQ/P0.4_1V8 (out), I2C2_3V3 (harness I2C), I2C2_IRQ/P2.0 (out), I2C3_3V3 (harness I2C), I2C_DBG_3V3 (harness I2C), PA_AUX_N, PA_AUX_P, PA_CC1, PA_CC2, PA_EXT (out), PA_SBRX, PA_SBTX, PA_SBU1, PA_SBU2, PA_VBUS (in), XRES_1V8 (in)

### Harnesses
I2C: SDA, SCL

### Nets
7V-24V: D9.A
+3V3: R275.1
+5V: R276.2 ; port 5V
CYPD_VDDIO: C46.2 C360.2 R90.1 R91.1 R271.2 R274.2 R333.1 R334.1 R335.1 R501.1 R502.2 TP29.X U5.31(VDDIO) ; sheet T8CH_/VCCB
GND: C40.1 C41.1 C42.1 C43.1 C44.2 C45.1 C46.1 C47.1 C48.1 C49.1 C84.1 C302.1 C303.2 C304.1 C308.1 C351.2 C352.2 C353.2 C354.2 C355.1 C356.2 C357.2 C359.1 C360.1 DL2.C R88.1 R89.1 R92.2 R172.1 R173.2 R247.2 R324.1 R325.2 R460.1 R499.1 R500.1 TP36.X U5.13(GND) U5.53(EPAD) U26.8(AGND) U26.13(PGND) U30.3(GND) U30.7(GND_PAD)
SOM_VREG_MDPX3_1P8: R330.1 R331.1 R332.1 ; sheet T8CH_/VCCA
EDP0_AUX_N: U5.35(PA_AUX_N) ; port PA_AUX_N
EDP0_AUX_P: U5.36(PA_AUX_P) ; port PA_AUX_P
GPIO4_SWDIO: TP39.X U5.27(GPIO4/LSTX_DIR_SEL/SWD_IO/P5.0) ; sheet T8CH_/3V3_B4
GPIO5_SWCLK: TP38.X U5.28(GPIO5/SWD_CLK/P5.1) ; sheet T8CH_/3V3_B5
I2C1_IRQ: R99.1 R333.2 ; sheet T8CH_/3V3_B1
I2C1_SCL: R100.1 R334.2 ; sheet T8CH_/3V3_B2
I2C1_SDA: R101.1 R335.2 ; sheet T8CH_/3V3_B3
MD_GPIO_3: R186.1 R330.2 ; port I2C1_IRQ/P0.4_1V8
MD_GPIO_45: R237.1 R332.2 ; port I2C1_1V8.SDA
MD_GPIO_46: R235.1 R331.2 ; port I2C1_1V8.SCL
MD_GPIO_48: R178.1 ; port GPIO5_1V8
MD_GPIO_94: R161.1 ; port GPIO4_1V8
MD_GPIO_104: R187.1 ; port XRES_1V8
PA_VBUS: D4.A U5.41(PA_VBUS) U5.42(PA_VBUS) ; port PA_VBUS
USBC_CC1: C40.2 U5.40(PA_CC1) ; port PA_CC1
USBC_CC2: C41.2 U5.39(PA_CC2) ; port PA_CC2
USBC_SBU1: R88.2 U5.38(PA_SBU1) ; port PA_SBU1
USBC_SBU2: R89.2 U5.37(PA_SBU2) ; port PA_SBU2
XRES: C49.2 R90.2 TP37.X U5.24(XRES) ; sheet T8CH_/3V3_B6
NetC42_2: C42.2 C43.2 U5.29(LDO1_(VCCD))
NetC44_1: C44.1 C45.2 U5.30(LDO2_(VDDD))
NetC47_2: C47.2 C48.2 R274.1 R275.2 U5.32(VIN_3V3_(VSYS))
NetC84_2: C84.2 R276.1 U5.46(5_V) U5.47(5_V) U5.48(5_V) U5.49(5_V)
NetC302_2: C302.2 C303.1 R504.1 U30.1(IN) U30.2(IN)
NetC304_2: C304.2 C308.2 R234.2 R501.2 U30.6(OUT)
NetC350_1: C350.1 U26.4(BOOT)
NetC350_2: C350.2 L10.1 U26.1(SW) U26.2(SW) U26.3(SW)
NetC351_1: C351.1 C352.1 C356.1 C357.1 R398.2 R505.1 U26.10(VIN) U26.11(VIN) U26.12(VIN)
NetC353_1: C353.1 R398.1 R460.2 U26.9(EN)
NetC354_1: C354.1 C355.2 C359.2 L10.2 R498.2 R502.1 R503.2
NetC358_1: C358.1 R503.1
NetC358_2: C358.2 R498.1 R500.2 U26.7(FB)
NetD4_C: D4.C D9.C R504.2 R505.2
NetDL2_A: DL2.A R106.1
NetQ3_2: R368.1 ; port GPIO3/P0.3_3V3
NetQ3_3: R367.1 ; port GPIO1/P0.1_3V3
NetR86_1: R86.1 ; port I2C2_IRQ/P2.0
NetR86_2: R86.2 U5.21(I2C2_IRQ/P2.0)
NetR87_1: R87.1 ; port I2C2_3V3.SCL
NetR87_2: R87.2 U5.22(I2C2_SCL/P2.1)
NetR91_2: R91.2 R92.1 U5.52(I2CADDR/P3.3)
NetR97_1: R102.1 ; port I2C3_3V3.SCL
NetR98_1: R103.1 ; port I2C3_3V3.SDA
NetR99_2: R99.2 U5.18(I2C1_IRQ/P0.4)
NetR100_2: R100.2 U5.19(I2C1_SCL/P1.0)
NetR101_2: R101.2 U5.20(I2C1_SDA/P1.1)
NetR102_2: R102.2 U5.25(I2C3_SCL/P2.3)
NetR103_2: R103.2 U5.26(I2C3_SDA/P2.4)
NetR104_1: R104.1 ; port I2C2_3V3.SDA
NetR104_2: R104.2 U5.23(I2C2_SDA/P2.2)
NetR106_2: R106.2 U5.51(GPIO9/P4.1)
NetR113_1: R113.1 ; port I2C_DBG_3V3.SDA
NetR113_2: R113.2 U5.11(PA_DBG_SDA)
NetR114_1: R114.1 ; port I2C_DBG_3V3.SCL
NetR114_2: R114.2 U5.12(PA_DBG_SCL)
NetR161_2: R161.2 ; sheet T8CH_/1V8_A4
NetR172_2: R172.2 ; sheet T8CH_/1V8_A7
NetR173_1: R173.1 ; sheet T8CH_/3V3_B7
NetR178_2: R178.2 ; sheet T8CH_/1V8_A5
NetR186_2: R186.2 ; sheet T8CH_/1V8_A1
NetR187_2: R187.2 ; sheet T8CH_/1V8_A6
NetR215_1: U5.43(PA_EXT/P4.0) ; port PA_EXT
NetR234_1: R234.1 R236.2
NetR235_2: R235.2 ; sheet T8CH_/1V8_A2
NetR236_1: R236.1 R244.2
NetR237_2: R237.2 ; sheet T8CH_/1V8_A3
NetR244_1: R244.1 R246.1
NetR246_2: R246.2 R247.1 U30.4(FB)
NetR271_1: R271.1 R367.2 U5.15(GPIO1/P0.1)
NetR324_2: R324.2 ; sheet T8CH_/1V8_A8
NetR325_1: R325.1 ; sheet T8CH_/3V3_B8
NetR368_2: R368.2 U5.17(GPIO3/P0.3)
NetR369_1: R369.1 ; port GPIO0/RTM_RST/P0.0_3V3
NetR369_2: R369.2 U5.14(GPIO0/RTM_RST/P0.0)
NetR370_1: R370.1 ; port GPIO2/RTM_EN/P0.2_3V3
NetR370_2: R370.2 U5.16(GPIO2/RTM_EN/P0.2)
NetR499_2: R499.2 U26.6(RT)
NetU5_33: U5.33(PA_SBRX) ; port PA_SBRX
NetU5_34: U5.34(PA_SBTX) ; port PA_SBTX
NetU5_45: U5.45(GPIO7/DEBUG#/P3.1) ; port GPIO7/DEBUG#/P3.1_3V3
NetU5_50: U5.50(GPIO8/PROCHOT#/P3.2) ; port GPIO8/PROCHOT#/P3.2_3V3

Not connected (* = marked no-connect by the designer): U5 1(NC)* 2(NC)* 3(NC)* 4(NC)* 5(NC)* 6(NC)* 7(NC)* 8(NC)* 9(NC)* 10(NC)* 44(GPIO6/FAULT#/P3.0)*; U26 5(PG)*; U30 5(NC)*

### Layout directives
net class HIGH_CLEARANCE: NetC302_2, NetC351_1, NetD4_C

### Notes on the sheet
- FAULT LED
- (near DL2) FAULT LED RED
- 3V3 LOCAL LDO
- 3V3 LOCAL DCDC
- Title:
- ID:
- Date:
- Time:
- Version:
- Sheet
- of
- RevAuthor:
- Reference Designs ARE PROVIDED "AS IS" AND "WITH ALL FAULTS. Arduino SA DISCLAIMS ALL OTHER WARRANTIES, EXPRESS OR IMPLIED, REGARDING PRODUCTS, INCLUDING BUT NOT LIMITED TO, ANY IMPLIED WARRANTIES OF MERCHANTABILITY OR FITNESS FOR A PARTICULAR PURPOSE.
  Arduino SA may make changes to specifications and product descriptions at any time, without notice. The Customer must not rely on the absence or characteristics of any features or instructions marked "reserved" or "undefined".
  Arduino SA reserves these for future definition and shall have no responsibility whatsoever for conflicts or incompatibilities arising from future changes to them. The product information on the Web Site or Materials is subject to change without notice.
  Do not finalize a design with this info. ARDUINO and other Arduino brands and logos and Trademarks of Arduino SA. All Arduino SA Trademarks cannot be used without owner's formal permission.
- File:
- Author:
- (in symbol U0495-A.3) OUT bypass only

### Library data of the parts
C40 C41 = C0197-A.2: CAP CHIP 0402 390pF 10% 50V X7R; Manufacturer: Murata; Code Arduino: C0197; Part Number: CL05B391KB5NNNC; Technology: Ceramic; Tolerance: 10%; Dielectric: X7R
C42 C48 C304 C308 C360 = C0002-A.15: CAP CHIP 0201 1uF 20% 6.3V X5R; Manufacturer: Murata; Code Arduino: A5520; Tolerance: 20%; Dielectric: X5R; Part Number: GRM033R60J105MEA2D; Technology: Ceramic
C43 C45-C47 C49 = C0113-A.6: as C54-C60 on sheet USB_MUX; Technology: Ceramic; Part Number: CL03A104KP3NNNC; Dielectric: X5R; Tolerance: 10%
C44 = C0037-A.14: CAP CHIP 0402 4.7uF 20% 6V3 X5R; Manufacturer: Hottech; Code Arduino: 0833; Dielectric: X5R; Technology: Ceramic; Part Number: C1005A475M6R3NT; Manufacturer 2: Samsung Electro-Mechanics; Tolerance: 20%; Manufacturer 3: Murata Electronics; Part number 3: GRM155R60J475ME47D; Part number 2: CL05A475KQ5NRNC
C84 C303 C350 C351 C353 C354 = C0015-A.14: CAP CHIP 0402 100nF 10% 50V X5R; Manufacturer: Murata; Code Arduino: A5141; Technology: Ceramic; Part Number: GRM155R61H104KE19D; Dielectric: X5R; Tolerance: 10%
C302 C352 C356 C357 = C0158-A.3: CAP CHIP 0805 10uF 20% 50V X5R; Manufacturer: Murata Electronics; Code Arduino: C0158; Dielectric: X5R; Technology: SMD; Part Number: GRM21BR61H106ME43L; Tolerance: 20%
C355 C359 = C0199-A.1: as C35 on sheet USB; Technology: Ceramic; Tolerance: 20%; Part Number: C0805C476M9PAC7800
C358 = C0115-A.6: CAP CHIP 0201 22pF 5% 25V C0G; Manufacturer: Yageo; Code Arduino: C0115; Part Number: CC0201JPNPO8BN220; Technology: Ceramic; Dielectric: C0G
D4 D9 = D0109-A.2: DIODE SCHOTTKY SMD 3A 40V SMA DO214AC; Part Number: SX34-AU_R1_000A1; Manufacturer: Panjit; Code Arduino: D0109; Forward Voltage: 0.39V; Device Type: Diode Schottky
DL2 = L0024-A.4: LED SMD 0603 RED 625nm, water clear, 42 to 88 mcd, 120 degrees, 1.6x0.8x0.6mm; Manufacturer: Shenzen Corehy Technology; Code Arduino: L0024; Pin Count: 2; Part Number: XHY-STB0603SR
L10 = I0133-A.2: IND SMD 4.7uH 20%, DCR max 65mR, I sat 3A, I RMS 2.2A, package 5x5mm height 3mm; Manufacturer: Shun Xiang Nuo; DCR max: 65m; Code Arduino: I0133; Part Number: SMNR5030-4R7MT; ISAT: 3A
R86 R87 R99-R104 R113 R114 R161 R178 R186 R187 R235 R237 R274 R275 R367-R370 R499 R501 R504 = R0140-A.21: as R94 on sheet USB_MUX; Technology: Thick film; Part Number: CRCW02010000Z0ED
  R86 R87 R99-R104 R113 R114 R161 R178 R186 R187 R235 R237 R274 R275 R367-R370: Case Code (Imperial): 0201
R88 R89 = R0394-A.1: RES CHIP 0402 2M 1% 1/16W; Manufacturer: YAGEO; Temperature coefficient: 100ppm; Code Arduino: R0394; Power: 62.5mW; Technology: Thick film; Part Number: RC0402FR-072ML; Tolerance: 1%
R90 R333-R335 = R0151-A.21: RES CHIP 0201 4k7 1% 1/20W; Manufacturer: Yageo; Power: 50mW; Temperature coefficient: 200ppm; Code Arduino: A5521; Tolerance: 1%; Case Code (Imperial): 0201; Technology: Thick film; Part Number: RC0201FR-074K7L
R91 R92 R330-R332 R503 = R0195-A.22: RES CHIP 0201 1k 1% 1/20W; Manufacturer: Yageo; Power: 50mW; Temperature coefficient: 200ppm; Code Arduino: R0195; Part Number: RC0201FR-071KL; Tolerance: 1%; Technology: Thick film
  R91 R92 R330-R332: Case Code (Imperial): 0201
R106 = R0149-A.21: RES CHIP 0201 330R 1% 1/20W; Manufacturer: Yageo; Power: 50mW; Code Arduino: R0149; Temperature coefficient: 200ppm; Case Code (Imperial): 0201; Manufacturer 2: Samsung Electro-Mechanics; Tolerance: 1%; Part Number: AC0201FR-07330RL; Technology: Thick film
R172 R173 R324 R325 = R0145-A.21: as R154 on sheet USB; Manufacturer 2: Samsung Electro-Mechanics; Tolerance: 1%; Case Code (Imperial): 0201; Part Number: RC0201FR-0710KL; Technology: Thick film
R234 R236 R271 = R0398-A.1: as R25 on sheet USB; Case Code (Imperial): 0201; Part Number: RC0201FR-0724KL; Technology: Thick film; Tolerance: 1%
R244 = R0146-A.21: RES CHIP 0201 100k 1% 1/20W; Manufacturer: Yageo; Power: 50mW; Temperature coefficient: 200ppm; Code Arduino: R0146; Manufacturer 2: Samsung Electro-Mechanics; Tolerance: 1%; Case Code (Imperial): 0201; Part Number: RC0201FR-07100KL; Technology: Thick film
R246 R247 = R0199-A.20: as R436 on sheet USB; Part Number: AC0201FR-07220KL; Tolerance: 1%; Case Code (Imperial): 0201; Technology: Thick film
R276 R502 R505 = R0131-A.13: RES CHIP 0805 0R; Manufacturer: Vishay; Temperature coefficient: 0ppm; Code Arduino: A5394; Power: 125mW; Tolerance: 0%; Technology: Thick film; Part Number: CRCW08050000Z0EB
R398 R460 = R0001-A.24: RES CHIP 0402 100k 1% 1/16W; Manufacturer: Vishay; Code Arduino: 0134; Temperature coefficient: 100ppm; Power: 62.5mW; Technology: Thick film; Part Number: CRCW0402100KFKEDC; Tolerance: 1%
R498 = R0146-A.21: RES CHIP 0201 100k 1% 1/20W; Manufacturer: Yageo; Code Arduino: R0146; Temperature coefficient: 200ppm; Power: 50mW; Technology: Thick film; Part Number: RC0201FR-07100KL; Manufacturer 2: Samsung Electro-Mechanics
R500 = R0420-A.1: RES CHIP 0201 31k6 1% 1/20W 100ppm; Manufacturer: Vishay; Power: 50mW; Code Arduino: R0420; Technology: Thick film; Part Number: CRCW020131K6FKED
TP29 TP36-TP39 = UT0013-A.6: Part Number: This is not a component; Design Item ID: CMP-018-0005-A.3; Source: ut.SchLib; Manufacturer: This is not a component; Code Arduino: This is not a component; Pin Count: 1
U5 = U0495-A.3: IC Controller power delivery USB-C, QFN52 5x8mm; Manufacturer: Infineon; Code Arduino: U0495; Part Number: CYPD6129-52LQXI
U26 = U0467-A.1: IC BUCK Vin 4-36V, Iout 4A, max duty 97%, fsw 1.1MHz, WSON8 3x3mm; Manufacturer: Texas Instruments; Code Arduino: U0467; Part Number: LMR51440SDRRR
U30 = U0518-A.2: IC LDO, Vin 2.5V-40V, Vout ADJ, Iout 0.15A, Iq typ 15uA, QFN6 2x2mm; Manufacturer: MPS; Code Arduino: U0518; Part Number: MP2013GG-Z

## Sheet TRANSLATOR_8CH.SchDoc: TRANSLATOR 8CH
size A4; Author: Silvio Navaretti; CompanyName: ARDUINO; DrawnBy: Silvio Navaretti; Engineer: Silvio Navaretti; Organization: ARDUINO; SheetNumber: 51; SheetTotal: 51; RevAuthor: Silvio Navaretti
Used 5 times, as channels U_USB/U_USB_PD_CONTROLLER/T8CH_, U_HEADERS_JHAT/T8CH_, U_HEADERS_JHAT/T8CH_, U_HEADERS_JHAT/T8CH_, T8CH_. Parts and nets are listed once, with the designators drawn on the sheet.
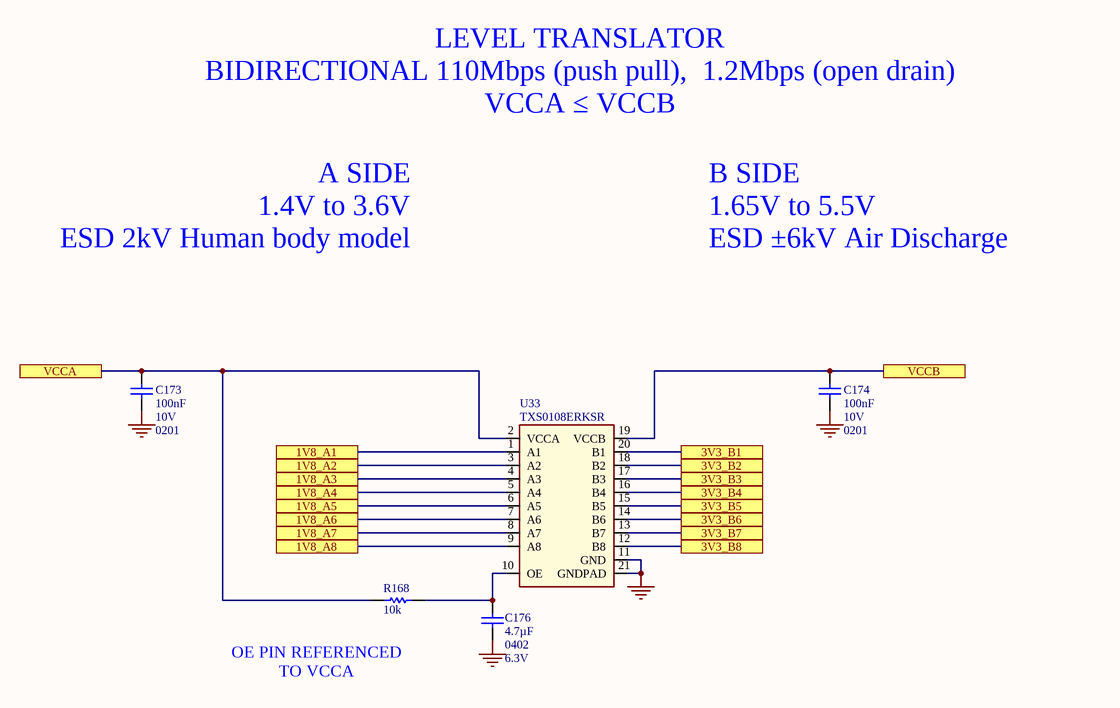
[diagram p15: TRANSLATOR_8CH.SchDoc]

### Parts
C173  value 100nF  Voltage: 10V  Case Code (Imperial): 0201  [CAP-0201]  (hidden comment: CL03A104KP3NNNC)
C174  value 100nF  Voltage: 10V  Case Code (Imperial): 0201  [CAP-0201]  (hidden comment: CL03A104KP3NNNC)
C176  value 4.7µF  Case Code (Imperial): 0402  Voltage: 6.3V  [CAP-0402]  (hidden comment: C1005A475M6R3NT)
R168  value 10k  [RES-0201]  (hidden comment: RC0201FR-0710KL)
U33  TXS0108ERKSR  [QFN50P250X450X100_HS-21N]

### Ports
1V8_A1, 1V8_A2, 1V8_A3, 1V8_A4, 1V8_A5, 1V8_A6, 1V8_A7, 1V8_A8, 3V3_B1, 3V3_B2, 3V3_B3, 3V3_B4, 3V3_B5, 3V3_B6, 3V3_B7, 3V3_B8, VCCA, VCCB

### Nets
GND: C173.1 C174.1 C176.2 U33.11(GND) U33.21(GNDPAD)
1V8_A1: U33.1(A1) ; port 1V8_A1
1V8_A2: U33.3(A2) ; port 1V8_A2
1V8_A3: U33.4(A3) ; port 1V8_A3
1V8_A4: U33.5(A4) ; port 1V8_A4
1V8_A5: U33.6(A5) ; port 1V8_A5
1V8_A6: U33.7(A6) ; port 1V8_A6
1V8_A7: U33.8(A7) ; port 1V8_A7
1V8_A8: U33.9(A8) ; port 1V8_A8
3V3_B1: U33.20(B1) ; port 3V3_B1
3V3_B2: U33.18(B2) ; port 3V3_B2
3V3_B3: U33.17(B3) ; port 3V3_B3
3V3_B4: U33.16(B4) ; port 3V3_B4
3V3_B5: U33.15(B5) ; port 3V3_B5
3V3_B6: U33.14(B6) ; port 3V3_B6
3V3_B7: U33.13(B7) ; port 3V3_B7
3V3_B8: U33.12(B8) ; port 3V3_B8
VCCA: C173.2 R168.2 U33.2(VCCA) ; port VCCA
VCCB: C174.2 U33.19(VCCB) ; port VCCB
NetC176_1: C176.1 R168.1 U33.10(OE)

### Channels
U_USB/U_USB_PD_CONTROLLER/T8CH_: designators end in _1; ports 1V8_A1=NetR186_2 1V8_A2=NetR235_2 1V8_A3=NetR237_2 1V8_A4=NetR161_2 1V8_A5=NetR178_2 1V8_A6=NetR187_2 1V8_A7=NetR172_2 1V8_A8=NetR324_2 3V3_B1=I2C1_IRQ 3V3_B2=I2C1_SCL 3V3_B3=I2C1_SDA 3V3_B4=GPIO4_SWDIO 3V3_B5=GPIO5_SWCLK 3V3_B6=XRES 3V3_B7=NetR173_1 3V3_B8=NetR325_1 VCCA=SOM_VREG_MDPX3_1P8 VCCB=CYPD_VDDIO
U_HEADERS_JHAT/T8CH_: designators end in _2; ports 1V8_A1=MD_GPIO_109 1V8_A2=I2S_SCK 1V8_A3=MD_GPIO_85 1V8_A4=MD_GPIO_87 1V8_A5=MD_GPIO_83 1V8_A6=MD_GPIO_86 1V8_A7=MD_GPIO_18 1V8_A8=MD_GPIO_17 3V3_B1=JHAT_GPIO_27 3V3_B2=JHAT_GPIO_18 3V3_B3=JHAT_GPIO_17 3V3_B4=JHAT_GPIO_15 3V3_B5=JHAT_GPIO_4 3V3_B6=JHAT_GPIO_14 3V3_B7=JHAT_GPIO_3 3V3_B8=JHAT_GPIO_2 VCCA=SOM_VREG_MDPX3_1P8 VCCB=+3V3_LIMITED
U_HEADERS_JHAT/T8CH_: designators end in _3; ports 1V8_A1=MD_GPIO_28 1V8_A2=MD_GPIO_107 1V8_A3=MD_GPIO_27 1V8_A4=MD_GPIO_25 1V8_A5=MD_GPIO_106 1V8_A6=MD_GPIO_26 1V8_A7=MD_GPIO_105 1V8_A8=MD_GPIO_90 3V3_B1=JHAT_GPIO_8 3V3_B2=JHAT_GPIO_25 3V3_B3=JHAT_GPIO_11 3V3_B4=JHAT_GPIO_9 3V3_B5=JHAT_GPIO_24 3V3_B6=JHAT_GPIO_10 3V3_B7=JHAT_GPIO_23 3V3_B8=JHAT_GPIO_22 VCCA=SOM_VREG_MDPX3_1P8 VCCB=+3V3_LIMITED
U_HEADERS_JHAT/T8CH_: designators end in _4; ports 1V8_A1=I2S_WS 1V8_A2=MD_GPIO_81 1V8_A3=MD_GPIO_77 1V8_A4=MD_GPIO_80 1V8_A5=MD_GPIO_89 1V8_A6=MD_GPIO_20 1V8_A7=MD_GPIO_19 1V8_A8=MD_GPIO_88 3V3_B1=JHAT_GPIO_19 3V3_B2=JHAT_GPIO_13 3V3_B3=JHAT_GPIO_12 3V3_B4=JHAT_GPIO_6 3V3_B5=JHAT_GPIO_5 3V3_B6=JHAT_GPIO_1 3V3_B7=JHAT_GPIO_0 3V3_B8=JHAT_GPIO_7 VCCA=SOM_VREG_MDPX3_1P8 VCCB=+3V3_LIMITED
T8CH_: designators end in _5; ports 1V8_A1=MD_GPIO_46 1V8_A2=MD_GPIO_45 1V8_A3=MD_CCI_I2C0.SCL 1V8_A4=MD_CCI_I2C0.SDA 1V8_A5=MD_CCI_I2C2.SCL 1V8_A6=MD_CCI_I2C2.SDA 1V8_A7=MD_CCI_I2C4.SCL 1V8_A8=MD_CCI_I2C4.SDA 3V3_B1=MD_QUP1_SE4_I2C_3V3.SCL 3V3_B2=MD_QUP1_SE4_I2C_3V3.SDA 3V3_B3=MD_CCI_I2C0_3V3.SCL 3V3_B4=MD_CCI_I2C0_3V3.SDA 3V3_B5=MD_CCI_I2C2_3V3.SCL 3V3_B6=MD_CCI_I2C2_3V3.SDA 3V3_B7=MD_CCI_I2C4_3V3.SCL 3V3_B8=MD_CCI_I2C4_3V3.SDA VCCA=SOM_VREG_MDPX3_1P8 VCCB=+3V3

### Notes on the sheet
- LEVEL TRANSLATOR
  BIDIRECTIONAL 110Mbps (push pull),  1.2Mbps (open drain)
  VCCA ≤ VCCB
- A SIDE
  1.4V to 3.6V
  ESD 2kV Human body model
- B SIDE
  1.65V to 5.5V
  ESD ±6kV Air Discharge
- (near R168) OE PIN REFERENCED TO VCCA
- Title:
- ID:
- Date:
- Time:
- Version:
- Sheet
- of
- RevAuthor:
- Reference Designs ARE PROVIDED "AS IS" AND "WITH ALL FAULTS. Arduino SA DISCLAIMS ALL OTHER WARRANTIES, EXPRESS OR IMPLIED, REGARDING PRODUCTS, INCLUDING BUT NOT LIMITED TO, ANY IMPLIED WARRANTIES OF MERCHANTABILITY OR FITNESS FOR A PARTICULAR PURPOSE.
  Arduino SA may make changes to specifications and product descriptions at any time, without notice. The Customer must not rely on the absence or characteristics of any features or instructions marked "reserved" or "undefined". Arduino SA reserves these for future definition and shall have no responsibility whatsoever for conflicts or incompatibilities arising from future changes to them. The product information on the Web Site or Materials is subject to change without notice.
  Do not finalize a design with this info. ARDUINO and other Arduino brands and logos and Trademarks of Arduino SA. All Arduino SA Trademarks cannot be used without owner's formal permission.
- File:
- Author:

### Library data of the parts
C173 C174 = C0113-A.6: as C54-C60 on sheet USB_MUX; Technology: Ceramic; Part Number: CL03A104KP3NNNC; Dielectric: X5R; Tolerance: 10%
C176 = C0037-A.14: as C44 on sheet USB_PD_CONTROLLER; Dielectric: X5R; Technology: Ceramic; Part Number: C1005A475M6R3NT; Manufacturer 2: Samsung Electro-Mechanics; Tolerance: 20%; Manufacturer 3: Murata Electronics; Part number 3: GRM155R60J475ME47D; Part number 2: CL05A475KQ5NRNC
R168 = R0145-A.21: as R154 on sheet USB; Manufacturer 2: Samsung Electro-Mechanics; Tolerance: 1%; Case Code (Imperial): 0201; Part Number: RC0201FR-0710KL; Technology: Thick film
U33 = U0456-A.4: IC TRANSLATOR LEVEL SHIFTER BIDIR 8b, push pull 110Mbps, open drain 1.2Mbps, VCCA 1.4V-3.6V, VCCB 1.6V-5.5V, VCCA≤VCCB, Output Enable, VQFN-20; Manufacturer: Texas Instruments; Code Arduino: U0456; Part Number: TXS0108ERKSR; LCSC Part #: C43138309

## Sheet USB_USBA.SchDoc: USBA
size A3; Author: Silvio Navaretti; CompanyName: ARDUINO; DrawnBy: Silvio Navaretti; Engineer: Silvio Navaretti; Organization: ARDUINO; SheetNumber: 34; SheetTotal: 51; RevAuthor: Silvio Navaretti
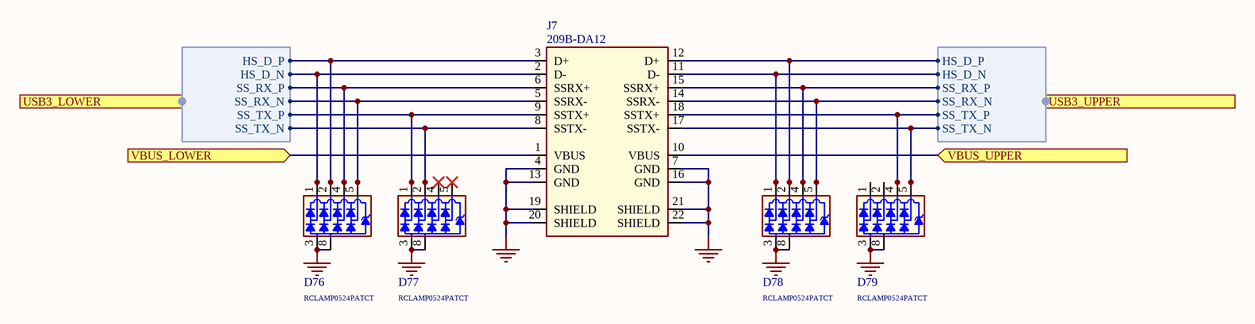
[diagram p16: USB_USBA.SchDoc]

### Parts
D76  RCLAMP0524PATCT  [SLP2510P8]
D77  RCLAMP0524PATCT  [SLP2510P8]
D78  RCLAMP0524PATCT  [SLP2510P8]
D79  RCLAMP0524PATCT  [SLP2510P8]
J7  209B-DA12  [209B-DA12]

### Ports
USB3_LOWER (harness SOM_MD_USB0), USB3_UPPER (harness SOM_MD_USB0), VBUS_LOWER (in), VBUS_UPPER (in)

### Harnesses
SOM_MD_USB0: SS_TX_N, SS_TX_P, HS_D_P, HS_D_N, SS_RX_P, SS_RX_N

### Nets
GND: D76.3 D76.8 D77.3 D77.8 D78.3 D78.8 D79.3 D79.8 J7.4(GND) J7.7(GND) J7.13(GND) J7.16(GND) J7.19(SHIELD) J7.20(SHIELD) J7.21(SHIELD) J7.22(SHIELD)
USB2_CAP_SSTX_N: D79.5 D79.6 J7.17(SSTX-) ; port USB3_UPPER.SS_TX_N
USB2_CAP_SSTX_P: D79.4 D79.7 J7.18(SSTX+) ; port USB3_UPPER.SS_TX_P
USB2_D_N: D78.1 D78.10 J7.11(D-) ; port USB3_UPPER.HS_D_N
USB2_D_P: D78.2 D78.9 J7.12(D+) ; port USB3_UPPER.HS_D_P
USB2_SSRX_N: D78.5 D78.6 J7.14(SSRX-) ; port USB3_UPPER.SS_RX_N
USB2_SSRX_P: D78.4 D78.7 J7.15(SSRX+) ; port USB3_UPPER.SS_RX_P
USB4_CAP_SSTX_N: D77.2 D77.9 J7.8(SSTX-) ; port USB3_LOWER.SS_TX_N
USB4_CAP_SSTX_P: D77.1 D77.10 J7.9(SSTX+) ; port USB3_LOWER.SS_TX_P
USB4_D_N: D76.1 D76.10 J7.2(D-) ; port USB3_LOWER.HS_D_N
USB4_D_P: D76.2 D76.9 J7.3(D+) ; port USB3_LOWER.HS_D_P
USB4_SSRX_N: D76.5 D76.6 J7.5(SSRX-) ; port USB3_LOWER.SS_RX_N
USB4_SSRX_P: D76.4 D76.7 J7.6(SSRX+) ; port USB3_LOWER.SS_RX_P
NetC35_2: J7.10(VBUS) ; port VBUS_UPPER
NetC147_2: J7.1(VBUS) ; port VBUS_LOWER
NetD77_4: D77.4 D77.7
NetD77_5: D77.5 D77.6
NetD79_1: D79.1 D79.10
NetD79_2: D79.2 D79.9

### Notes on the sheet
- Title:
- ID:
- Date:
- Time:
- Version:
- Sheet
- of
- RevAuthor:
- Reference Designs ARE PROVIDED "AS IS" AND "WITH ALL FAULTS. Arduino SA DISCLAIMS ALL OTHER WARRANTIES, EXPRESS OR IMPLIED, REGARDING PRODUCTS, INCLUDING BUT NOT LIMITED TO, ANY IMPLIED WARRANTIES OF MERCHANTABILITY OR FITNESS FOR A PARTICULAR PURPOSE.
  Arduino SA may make changes to specifications and product descriptions at any time, without notice. The Customer must not rely on the absence or characteristics of any features or instructions marked "reserved" or "undefined".
  Arduino SA reserves these for future definition and shall have no responsibility whatsoever for conflicts or incompatibilities arising from future changes to them. The product information on the Web Site or Materials is subject to change without notice.
  Do not finalize a design with this info. ARDUINO and other Arduino brands and logos and Trademarks of Arduino SA. All Arduino SA Trademarks cannot be used without owner's formal permission.
- File:
- Author:

### Library data of the parts
D76-D79 = D0097-A.6: as D72 on sheet USB_USBC; Part Number: RCLAMP0524PATCT
J7 = J0560-A.4: CONN TH USB-A x2 stacked USB3.0 tab blue; Manufacturer: ATTEND; Code Arduino: J0560; Part Number: 209B-DA12